# EAGLE design schody.v2 (EAGLE 9.2.2)
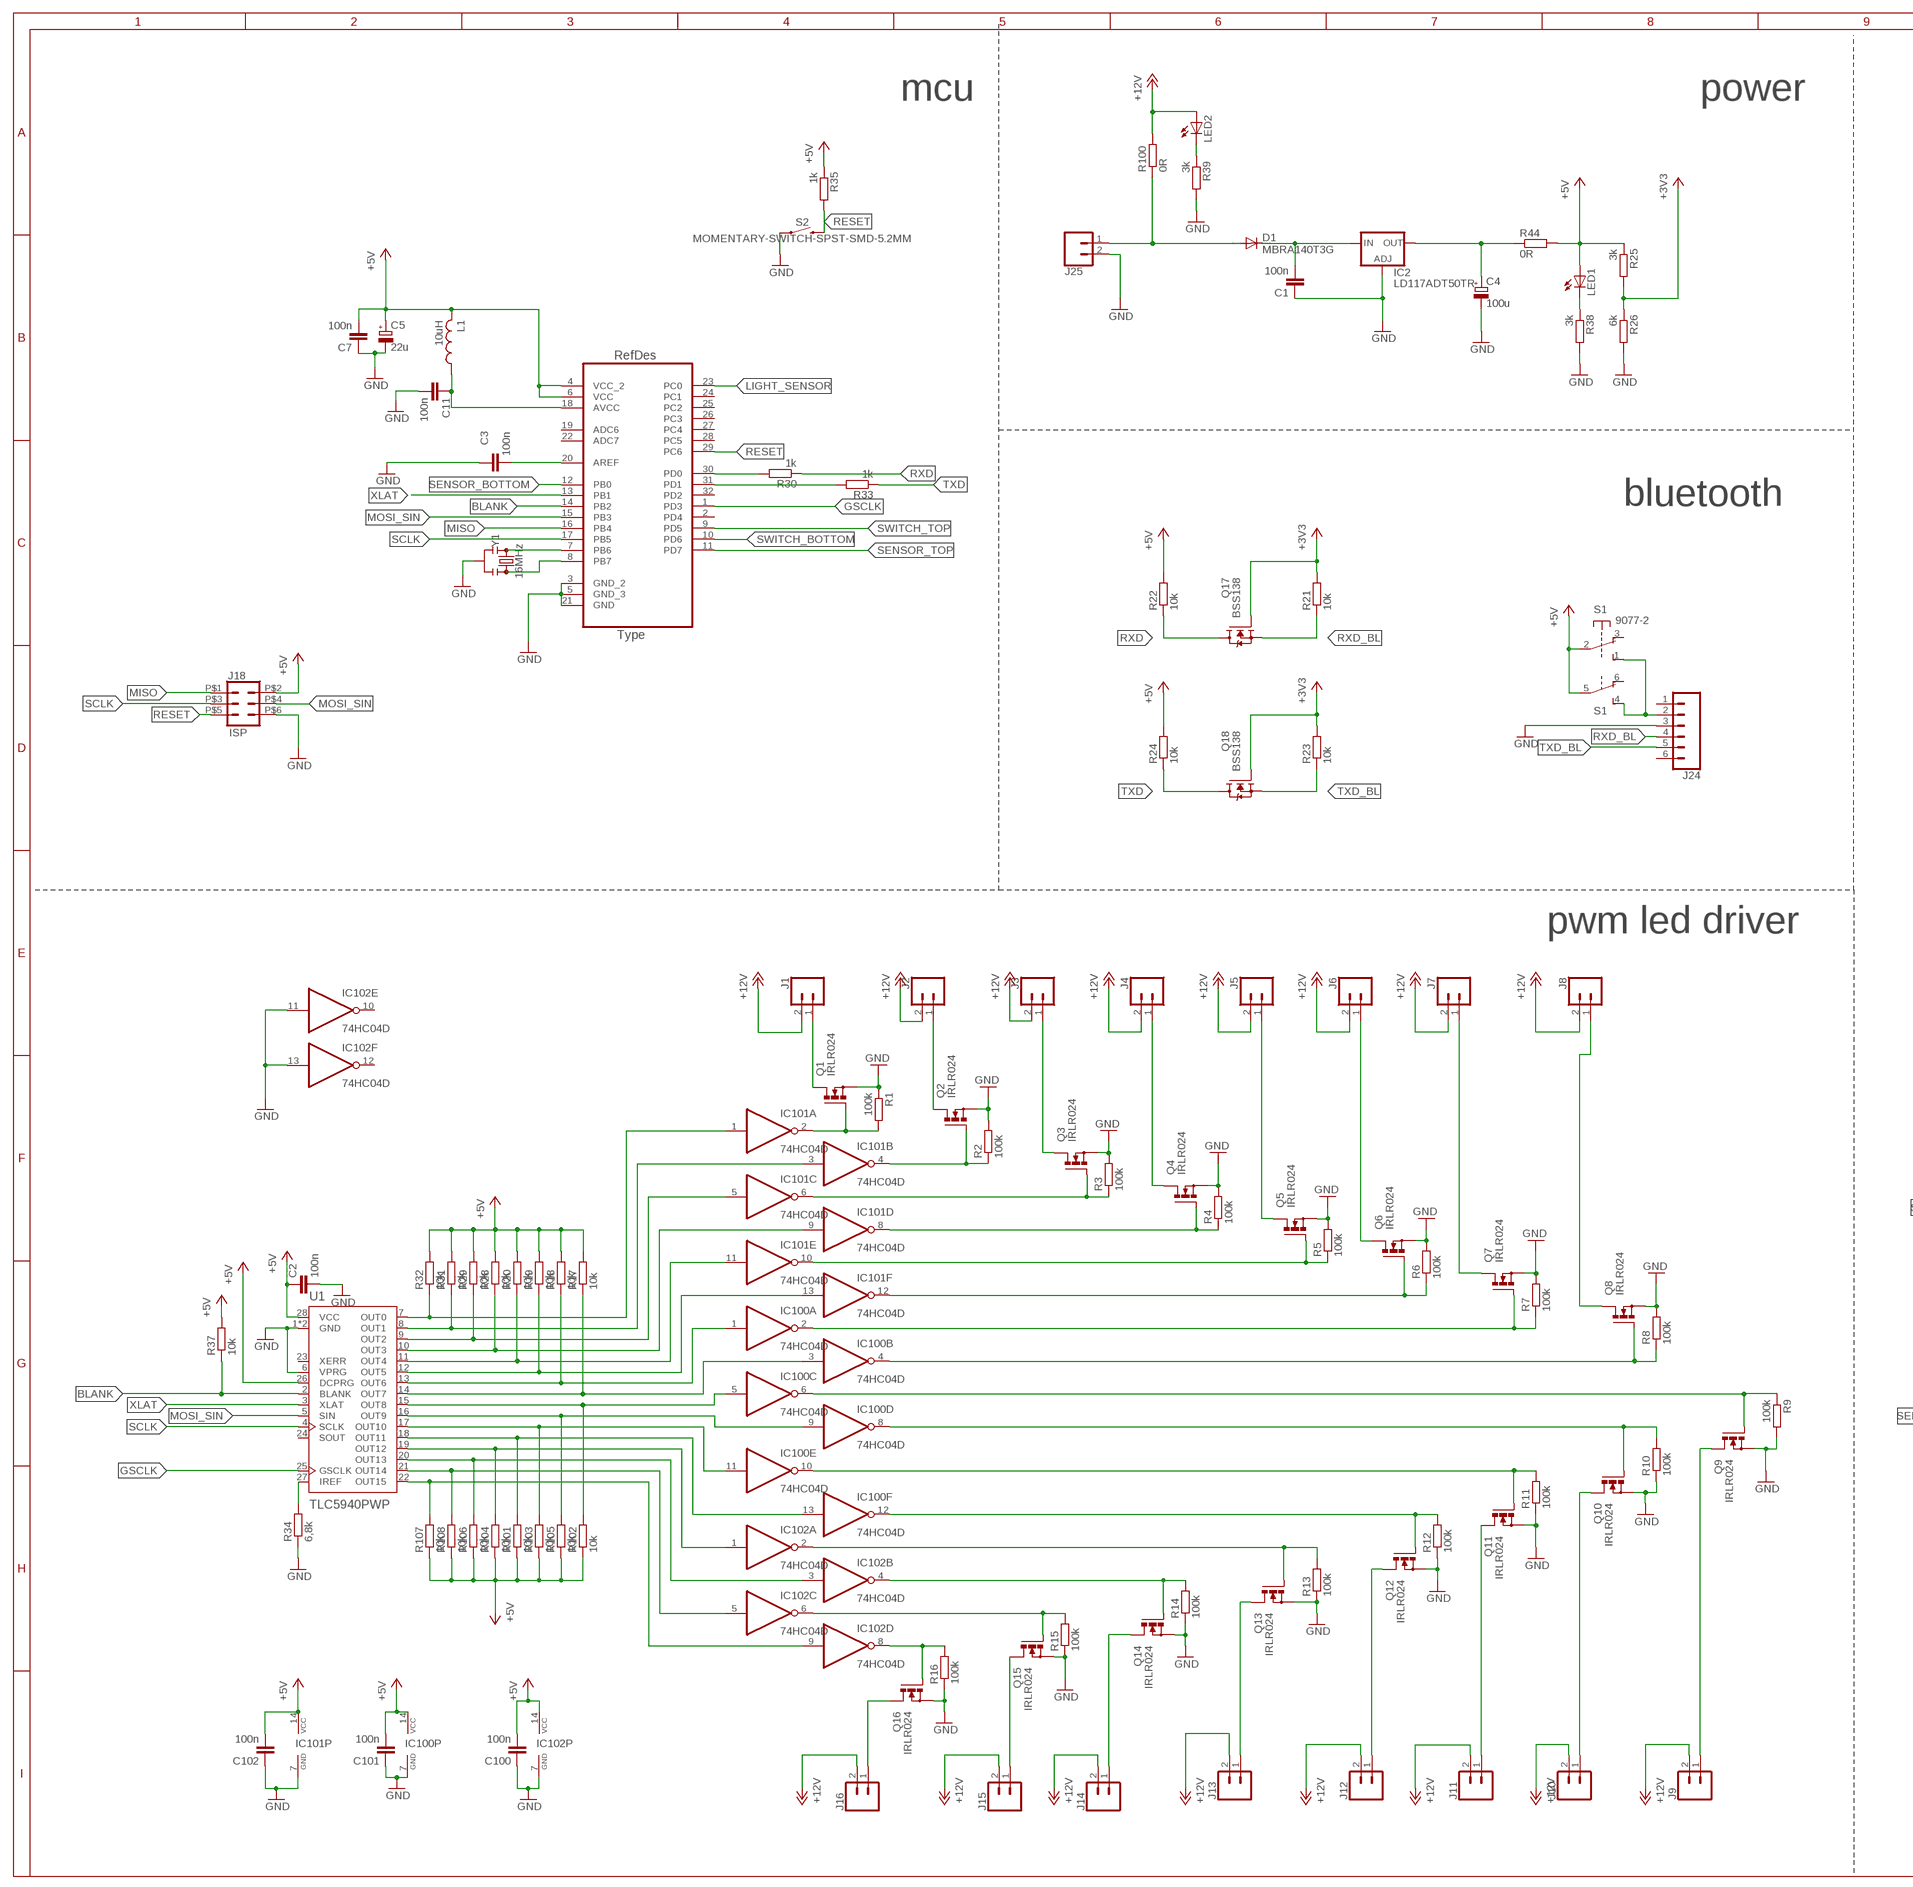
[diagram p0: schematic, sheet 1, part 1 of 2]
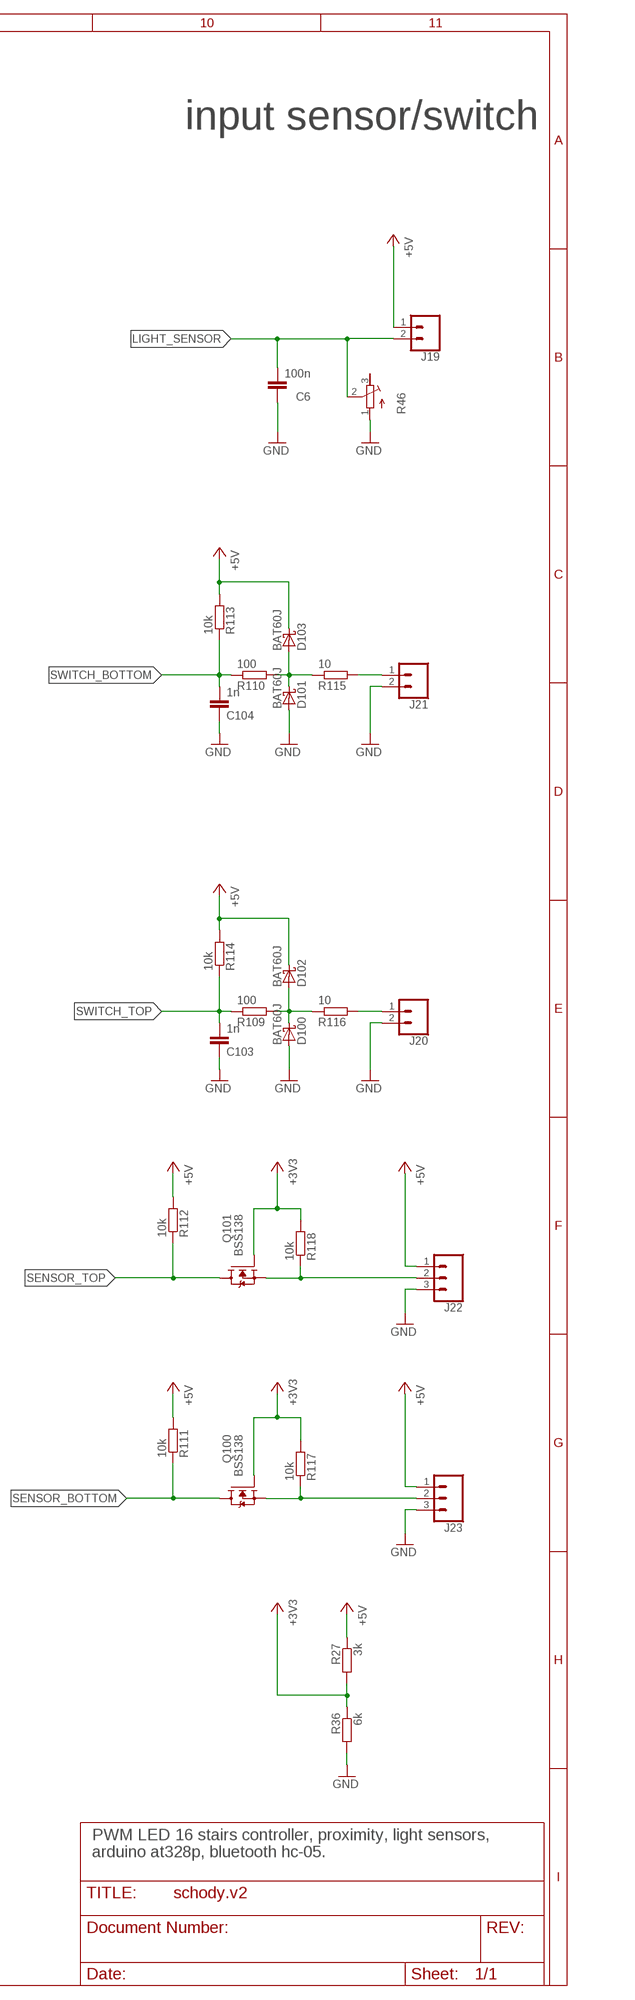
[diagram p1: schematic, sheet 1, part 2 of 2]

## Parts
C1  100n  C-EUC0805K  [C0805K]
C2  100n  C-EUC0805K  [C0805K]
C3  100n  C-EUC0805  [C0805]
C4  100u  CPOL-EUSMCD  [SMC_D]
C5  22u  CPOL-EUSMCE  [SMC_E]
C6  100n  C-EUC0805  [C0805]
C7  100n  C-EUC0805  [C0805]
C11  100n  C-EUC0805  [C0805]
C100  100n  C-EUC0805K  [C0805K]
C101  100n  C-EUC0805K  [C0805K]
C102  100n  C-EUC0805K  [C0805K]
C103  1n  C-EUC0805K  [C0805K]
C104  1n  C-EUC0805K  [C0805K]
D1  MBRA140T3G  DIODE-DO214BA  [DO214BA]
D100  BAT60J  [SOD323_ST]
D101  BAT60J  [SOD323_ST]
D102  BAT60J  [SOD323_ST]
D103  BAT60J  [SOD323_ST]
IC2  LD117ADT50TR  [DPACK]
IC100  74HC04D  [SO14]
IC101  74HC04D  [SO14]
IC102  74HC04D  [SO14]
J1  CONN_023.5MM  [SCREWTERMINAL-3.5MM-2]
J2  CONN_023.5MM  [SCREWTERMINAL-3.5MM-2]
J3  CONN_023.5MM  [SCREWTERMINAL-3.5MM-2]
J4  CONN_023.5MM  [SCREWTERMINAL-3.5MM-2]
J5  CONN_023.5MM  [SCREWTERMINAL-3.5MM-2]
J6  CONN_023.5MM  [SCREWTERMINAL-3.5MM-2]
J7  CONN_023.5MM  [SCREWTERMINAL-3.5MM-2]
J8  CONN_023.5MM  [SCREWTERMINAL-3.5MM-2]
J9  CONN_023.5MM  [SCREWTERMINAL-3.5MM-2]
J10  CONN_023.5MM  [SCREWTERMINAL-3.5MM-2]
J11  CONN_023.5MM  [SCREWTERMINAL-3.5MM-2]
J12  CONN_023.5MM  [SCREWTERMINAL-3.5MM-2]
J13  CONN_023.5MM  [SCREWTERMINAL-3.5MM-2]
J14  CONN_023.5MM  [SCREWTERMINAL-3.5MM-2]
J15  CONN_023.5MM  [SCREWTERMINAL-3.5MM-2]
J16  CONN_023.5MM  [SCREWTERMINAL-3.5MM-2]
J18  ISP  CONN_03X2POGO_PINS  [2X3_POGO]
J19  CONN_023.5MM  [SCREWTERMINAL-3.5MM-2]
J20  CONN_023.5MM  [SCREWTERMINAL-3.5MM-2]
J21  CONN_023.5MM  [SCREWTERMINAL-3.5MM-2]
J22  CONN_03SCREW  [SCREWTERMINAL-3.5MM-3]
J23  CONN_03SCREW  [SCREWTERMINAL-3.5MM-3]
J24  CONN_06LOCK  [1X06_LOCK]
J25  CONN_025MM  [SCREWTERMINAL-5MM-2]
L1  10uH  L_USB  [0805]
LED1  LEDCHIP-LED0805  [CHIP-LED0805]
LED2  LEDCHIP-LED0805  [CHIP-LED0805]
Q1  IRLR024  [D-PAK_TO252AA]
Q2  IRLR024  [D-PAK_TO252AA]
Q3  IRLR024  [D-PAK_TO252AA]
Q4  IRLR024  [D-PAK_TO252AA]
Q5  IRLR024  [D-PAK_TO252AA]
Q6  IRLR024  [D-PAK_TO252AA]
Q7  IRLR024  [D-PAK_TO252AA]
Q8  IRLR024  [D-PAK_TO252AA]
Q9  IRLR024  [D-PAK_TO252AA]
Q10  IRLR024  [D-PAK_TO252AA]
Q11  IRLR024  [D-PAK_TO252AA]
Q12  IRLR024  [D-PAK_TO252AA]
Q13  IRLR024  [D-PAK_TO252AA]
Q14  IRLR024  [D-PAK_TO252AA]
Q15  IRLR024  [D-PAK_TO252AA]
Q16  IRLR024  [D-PAK_TO252AA]
Q17  BSS138  [SOT23]
Q18  BSS138  [SOT23]
Q100  BSS138  [SOT23]
Q101  BSS138  [SOT23]
R1  100k  R-EU_M0805  [M0805]
R2  100k  R-EU_M0805  [M0805]
R3  100k  R-EU_M0805  [M0805]
R4  100k  R-EU_M0805  [M0805]
R5  100k  R-EU_M0805  [M0805]
R6  100k  R-EU_M0805  [M0805]
R7  100k  R-EU_M0805  [M0805]
R8  100k  R-EU_M0805  [M0805]
R9  100k  R-EU_M0805  [M0805]
R10  100k  R-EU_M0805  [M0805]
R11  100k  R-EU_M0805  [M0805]
R12  100k  R-EU_M0805  [M0805]
R13  100k  R-EU_M0805  [M0805]
R14  100k  R-EU_M0805  [M0805]
R15  100k  R-EU_M0805  [M0805]
R16  100k  R-EU_M0805  [M0805]
R17  10k  R-EU_M0805  [M0805]
R18  10k  R-EU_M0805  [M0805]
R19  10k  R-EU_M0805  [M0805]
R20  10k  R-EU_M0805  [M0805]
R21  10k  R-EU_M0805  [M0805]
R22  10k  R-EU_M0805  [M0805]
R23  10k  R-EU_M0805  [M0805]
R24  10k  R-EU_M0805  [M0805]
R25  3k  R-EU_M0805  [M0805]
R26  6k  R-EU_M0805  [M0805]
R27  3k  R-EU_M0805  [M0805]
R28  10k  R-EU_M0805  [M0805]
R29  10k  R-EU_M0805  [M0805]
R30  1k  R-EU_M0805  [M0805]
R31  10k  R-EU_M0805  [M0805]
R32  10k  R-EU_M0805  [M0805]
R33  1k  R-EU_M0805  [M0805]
R34  6,8k  R-EU_M0805  [M0805]
R35  1k  R-EU_M0805  [M0805]
R36  6k  R-EU_M0805  [M0805]
R37  10k  R-EU_M0805  [M0805]
R38  3k  R-EU_M0805  [M0805]
R39  3k  R-EU_M0805  [M0805]
R44  0R  R-EU_M1206  [M1206]
R46  R-TRIMM64W  [RTRIM64W]
R100  0R  R-EU_R2512  [R2512]
R101  10k  R-EU_M0805  [M0805]
R102  10k  R-EU_M0805  [M0805]
R103  10k  R-EU_M0805  [M0805]
R104  10k  R-EU_M0805  [M0805]
R105  10k  R-EU_M0805  [M0805]
R106  10k  R-EU_M0805  [M0805]
R107  10k  R-EU_M0805  [M0805]
R108  10k  R-EU_M0805  [M0805]
R109  100  R-EU_M0805  [M0805]
R110  100  R-EU_M0805  [M0805]
R111  10k  R-EU_M0805  [M0805]
R112  10k  R-EU_M0805  [M0805]
R113  10k  R-EU_M0805  [M0805]
R114  10k  R-EU_M0805  [M0805]
R115  10  R-EU_M0805  [M0805]
R116  10  R-EU_M0805  [M0805]
R117  10k  R-EU_M0805  [M0805]
R118  10k  R-EU_M0805  [M0805]
S1  9077-2  [9077-2]
S2  MOMENTARY-SWITCH-SPST-SMD-5.2MM  [TACTILE_SWITCH_SMD_5.2MM]
U1  TLC5940PWP  [HTSSOP28PWP]
U2  ATMEGA328P-AU  [QFP80P900X900X120-32N]
Y1  16MHz  RESONATOR-16MHZSMD_3.2X1.3  [RESONATOR-SMD-3.2X1.3]

## Nets
+3V3: Q17.1(G) Q18.1(G) R21.2 R23.2 R25.2 R26.1
+3V33: Q100.1(G) Q101.1(G) R27.2 R36.1 R117.2 R118.2 ; supply symbol labelled +3V3
+5V: C2.1 C5.+ C7.2 C100.2 C101.2 C102.2 D102.C D103.C IC100.14(P:VCC) IC101.14(P:VCC) IC102.14(P:VCC) J18.P$2 J19.1 J22.1 J23.1 L1.2 LED1.A R17.2 R18.2 R19.2 R20.2 R22.2 R24.2 R25.1 R27.1 R28.2 R29.2 R31.2 R32.2 R35.1 R37.2 R44.2 R101.1 R102.1 R103.1 R104.1 R105.1 R106.1 R107.1 R108.1 R111.2 R112.2 R113.2 R114.2 S1.2(1:P) S1.5(2:P) U1.26(DCPRG) U1.28(VCC) U2.4(VCC_2) U2.6(VCC)
+12V: J1.2 J2.2 J3.2 J4.2 J5.2 J6.2 J7.2 J8.2 J9.2 J10.2 J11.2 J12.2 J13.2 J14.2 J15.2 J16.2 LED2.A R100.2
BLANK: R37.1 U1.2(BLANK) U2.14(PB2)
GND: C1.1 C2.2 C3.1 C4.- C5.- C6.1 C7.1 C11.2 C100.1 C101.1 C102.1 C103.1 C104.1 D100.A D101.A IC2.1(ADJ) IC100.7(P:GND) IC101.7(P:GND) IC102.7(P:GND) IC102.11(E:I) IC102.13(F:I) J18.P$6 J20.2 J21.2 J22.3 J23.3 J24.3 J25.2 Q1.3(SOURCE) Q2.3(SOURCE) Q3.3(SOURCE) Q4.3(SOURCE) Q5.3(SOURCE) Q6.3(SOURCE) Q7.3(SOURCE) Q8.3(SOURCE) Q9.3(SOURCE) Q10.3(SOURCE) Q11.3(SOURCE) Q12.3(SOURCE) Q13.3(SOURCE) Q14.3(SOURCE) Q15.3(SOURCE) Q16.3(SOURCE) R1.1 R2.2 R3.2 R4.2 R5.2 R6.2 R7.2 R8.2 R9.2 R10.1 R11.1 R12.1 R13.1 R14.1 R15.1 R16.1 R26.2 R34.1 R36.2 R38.2 R39.2 R46.1(A) S2.1 U1.1(GND) U1.6(VPRG) U1.EXP(GND) U2.3(GND_2) U2.5(GND_3) U2.21(GND) Y1.2
GSCLK: U1.25(GSCLK) U2.1(PD3)
LIGHT_SENSOR: C6.2 J19.2 R46.2(S) U2.23(PC0)
MISO: J18.P$1 U2.16(PB4)
MOSI_SIN: J18.P$4 U1.5(SIN) U2.15(PB3)
N$1: IC101.1(A:I) R32.1 U1.7(OUT0)
N$2: IC101.3(B:I) R31.1 U1.8(OUT1)
N$3: IC101.5(C:I) R29.1 U1.9(OUT2)
N$4: IC101.9(D:I) R28.1 U1.10(OUT3)
N$5: IC101.11(E:I) R20.1 U1.11(OUT4)
N$6: IC101.13(F:I) R19.1 U1.12(OUT5)
N$7: IC100.1(A:I) R18.1 U1.13(OUT6)
N$8: IC100.3(B:I) R17.1 U1.14(OUT7)
N$9: IC102.9(D:I) R107.2 U1.22(OUT15)
N$10: IC101.2(A:O) Q1.1(GATE) R1.2
N$11: IC102.3(B:I) R106.2 U1.20(OUT13)
N$12: IC102.1(A:I) R104.2 U1.19(OUT12)
N$13: IC100.13(F:I) R101.2 U1.18(OUT11)
N$14: IC100.11(E:I) R103.2 U1.17(OUT10)
N$15: IC100.9(D:I) R105.2 U1.16(OUT9)
N$16: IC100.5(C:I) R102.2 U1.15(OUT8)
N$17: IC102.5(C:I) R108.2 U1.21(OUT14)
N$18: J2.1 Q2.2(DRAIN)
N$19: IC101.6(C:O) Q3.1(GATE) R3.1
N$20: J4.1 Q4.2(DRAIN)
N$21: IC100.4(B:O) Q8.1(GATE) R8.1
N$22: J3.1 Q3.2(DRAIN)
N$23: IC101.8(D:O) Q4.1(GATE) R4.1
N$24: IC102.8(D:O) Q16.1(GATE) R16.2
N$25: J16.1 Q16.2(DRAIN)
N$26: J1.1 Q1.2(DRAIN)
N$27: IC101.10(E:O) Q5.1(GATE) R5.1
N$28: J5.1 Q5.2(DRAIN)
N$29: J8.1 Q8.2(DRAIN)
N$30: IC101.12(F:O) Q6.1(GATE) R6.1
N$31: J10.1 Q10.2(DRAIN)
N$32: J6.1 Q6.2(DRAIN)
N$33: IC102.6(C:O) Q15.1(GATE) R15.2
N$34: J15.1 Q15.2(DRAIN)
N$35: J24.2 S1.1(1:S) S1.4(2:S)
N$36: IC102.4(B:O) Q14.1(GATE) R14.2
N$37: J14.1 Q14.2(DRAIN)
N$38: IC100.8(D:O) Q10.1(GATE) R10.2
N$39: IC102.2(A:O) Q13.1(GATE) R13.2
N$40: IC100.6(C:O) Q9.1(GATE) R9.1
N$41: J13.1 Q13.2(DRAIN)
N$42: J20.1 R116.2
N$43: IC100.12(F:O) Q12.1(GATE) R12.2
N$44: J12.1 Q12.2(DRAIN)
N$45: J9.1 Q9.2(DRAIN)
N$46: IC100.10(E:O) Q11.1(GATE) R11.2
N$47: J11.1 Q11.2(DRAIN)
N$48: J21.1 R115.2
N$49: R30.2 U2.30(PD0)
N$50: R33.2 U2.31(PD1)
N$51: C1.2 D1.C IC2.3(IN)
N$52: D1.A J25.1 R100.1
N$53: U2.7(PB6) Y1.1
N$54: U2.8(PB7) Y1.3
N$55: R34.2 U1.27(IREF)
N$56: LED1.C R38.1
N$57: D101.C D103.A R110.2 R115.1
N$58: LED2.C R39.1
N$59: D100.C D102.A R109.2 R116.1
N$63: J22.2 Q101.2(S) R118.1
N$64: J23.2 Q100.2(S) R117.1
N$65: C11.1 L1.1 U2.18(AVCC)
N$66: C4.+ IC2.4(OUT) R44.1
N$67: C3.2 U2.20(AREF)
N$70: IC101.4(B:O) Q2.1(GATE) R2.1
N$71: IC100.2(A:O) Q7.1(GATE) R7.1
N$73: J7.1 Q7.2(DRAIN)
RESET: J18.P$5 R35.2 S2.3 U2.29(PC6)
RXD: Q17.3(D) R22.1 R30.1
RXD_BL: J24.4 Q17.2(S) R21.1
SCLK: J18.P$3 U1.4(SCLK) U2.17(PB5)
SENSOR_BOTTOM: Q100.3(D) R111.1 U2.12(PB0)
SENSOR_TOP: Q101.3(D) R112.1 U2.11(PD7)
SWITCH_BOTTOM: C104.2 R110.1 R113.1 U2.10(PD6)
SWITCH_TOP: C103.2 R109.1 R114.1 U2.9(PD5)
TXD: Q18.3(D) R24.1 R33.1
TXD_BL: J24.5 Q18.2(S) R23.1
XLAT: U1.3(XLAT) U2.13(PB1)
Unconnected: IC102.10(E:O) IC102.12(F:O) J24.1 J24.6 R46.3(E) S1.3(1:O) S1.6(2:O) U1.23(XERR) U1.24(SOUT) U2.2(PD4) U2.19(ADC6) U2.22(ADC7) U2.24(PC1) U2.25(PC2) U2.26(PC3) U2.27(PC4) U2.28(PC5) U2.32(PD2)

## Notes on the sheet
- mcu | power
- input sensor/switch
- bluetooth
- pwm led driver
- PWM LED 16 stairs controller, proximity, light sensors, 
  arduino at328p, bluetooth hc-05.

## Library data of the parts
C1-C3 C6 C7 C11 C100-C104 = rcl:C-EU: CAPACITOR, European symbol; SPICEPREFIX: C
C4 C5 = rcl:CPOL-EU: POLARIZED CAPACITOR, European symbol; SPICEPREFIX: C
D1 = diode:DIODE-: DIODE
D100 D102 = diode:BAT60J: Schottky barrier diode Source: www.st.com, BAT60J.pdf; SPICEPREFIX: D
D101 D103 = diode:BAT60J: Schottky barrier diode Source: www.st.com, BAT60J.pdf
IC2 = v-reg:LD117A?*: Low drop fixed and adjustable positive voltage regulators 1 A Source: http://www.st.com/stonline/products/literature/ds/7194/ld1117axx.pdf
IC100-IC102 = 74xx-eu:74*04: Hex INVERTER
J1-J16 J19-J21 = SparkFun-Connectors:CONN_02: Multi connection point. Often used as Generic Header-pin footprint for 0.1 inch spaced/style header connections On any of the 0.1 inch spaced packages, you can populate with these: Break Away Headers - Straight <https://www.sparkfun.com/products/116> (PRT-00116) Break Away Male Headers - Right Angle <https://www.sparkfun.com/products/553> (PRT-00553) Female Headers <https://www.sparkfun.com/products/115> (PRT-00115) Break Away Headers - Machine Pin <https://www.sparkfun.com/products/117> (PRT-00117) Break Away Female Headers - Swiss Machine Pin <https://www.sparkfun.com/products/743> (PRT-00743) For SCREWTERMINALS and SPRING TERMINALS visit here: Screw Terimnals on SparkFun.com <https://www.sparkfun.com/search/results?term=Screw+Terminals> (5mm/3.5mm/2.54mm spacing) This device is also useful as a general connection point to wire up your design to another part of your project. Our various solder wires solder well into these plated through hole pads. Hook-Up Wire - Assortment (Stranded, 22 AWG) <https://www.sparkfun.com/products/11375> (PRT-11375) Hook-Up Wire - Assortment (Solid Core, 22 AWG) <https://www.sparkfun.com/products/11367> (PRT-11367) View the entire wire category on our website here <https://www.sparkfun.com/categories/141> Special notes: Molex polarized connector foot print use with: PRT-08233 with associated crimp pins and housings. 2.54_SCREWTERM for use with PRT-10571. 3.5mm Screw Terminal footprints for PRT-08084 5mm Screw Terminal footprints for use with PRT-08432; PROD_ID: CONN-08399
J18 = SparkFun-Connectors:CONN_03X2: Multi connection point. Often used as Generic Header-pin footprint for 0.1 inch spaced/style header connections You can populate with any combo of single row headers, but if you'd like an exact match, check these: Header - 2x3 (Male, 0.1") <https://www.sparkfun.com/products/12807> (PRT-12807) Header - 2x3 (Female, 0.1") <https://www.sparkfun.com/products/13010> (PRT-13010) 2x3 Pin Shrouded Header <https://www.sparkfun.com/products/10877> (PRT-10877) On any of the 0.1 inch spaced packages, you can populate with these: Break Away Headers - Straight <https://www.sparkfun.com/products/116> (PRT-00116) Break Away Male Headers - Right Angle <https://www.sparkfun.com/products/553> (PRT-00553) Female Headers <https://www.sparkfun.com/products/115> (PRT-00115) Break Away Headers - Machine Pin <https://www.sparkfun.com/products/117> (PRT-00117) Break Away Female Headers - Swiss Machine Pin <https://www.sparkfun.com/products/743> (PRT-00743) Special note: the shrouded connector mates well with our 3x2 ribbon cables: Ribbon Crimp Connector - 6-pin (2x3, Female) <https://www.sparkfun.com/products/10651> (PRT-10651) Ribbon Cable - 6 wire (15ft) <https://www.sparkfun.com/products/10646> (PRT-10646); PROD_ID: HW-11044
J22 J23 = SparkFun-Connectors:CONN_03: Multi connection point. Often used as Generic Header-pin footprint for 0.1 inch spaced/style header connections On any of the 0.1 inch spaced packages, you can populate with these: Break Away Headers - Straight <https://www.sparkfun.com/products/116> (PRT-00116) Break Away Male Headers - Right Angle <https://www.sparkfun.com/products/553> (PRT-00553) Female Headers <https://www.sparkfun.com/products/115> (PRT-00115) Break Away Headers - Machine Pin <https://www.sparkfun.com/products/117> (PRT-00117) Break Away Female Headers - Swiss Machine Pin <https://www.sparkfun.com/products/743> (PRT-00743) Stackable Header - 3 Pin (Female, 0.1") <https://www.sparkfun.com/products/13875> (PRT-13875) For SCREWTERMINALS and SPRING TERMINALS visit here: Screw Terimnals on SparkFun.com <https://www.sparkfun.com/search/results?term=Screw+Terminals> (5mm/3.5mm/2.54mm spacing) This device is also useful as a general connection point to wire up your design to another part of your project. Our various solder wires solder well into these plated through hole pads. Hook-Up Wire - Assortment (Stranded, 22 AWG) <https://www.sparkfun.com/products/11375> (PRT-11375) Hook-Up Wire - Assortment (Solid Core, 22 AWG) <https://www.sparkfun.com/products/11367> (PRT-11367) View the entire wire category on our website here <https://www.sparkfun.com/categories/141> Special notes: Molex polarized connector foot print use with SKU : PRT-08232 with associated crimp pins and housings.; PROD_ID: CONN-08288; SF_ID: PRT-08235
J24 = SparkFun-Connectors:CONN_06: Multi connection point. Often used as Generic Header-pin footprint for 0.1 inch spaced/style header connections On any of the 0.1 inch spaced packages, you can populate with these: Break Away Headers - Straight <https://www.sparkfun.com/products/116> (PRT-00116) Break Away Male Headers - Right Angle <https://www.sparkfun.com/products/553> (PRT-00553) Female Headers <https://www.sparkfun.com/products/115> (PRT-00115) Break Away Headers - Machine Pin <https://www.sparkfun.com/products/117> (PRT-00117) Break Away Female Headers - Swiss Machine Pin <https://www.sparkfun.com/products/743> (PRT-00743) Arduino Stackable Header - 6 Pin <https://www.sparkfun.com/products/9280> (PRT-09280) For SCREWTERMINALS and SPRING TERMINALS visit here: Screw Terimnals on SparkFun.com <https://www.sparkfun.com/search/results?term=Screw+Terminals> (5mm/3.5mm/2.54mm spacing) This device is also useful as a general connection point to wire up your design to another part of your project. Our various solder wires solder well into these plated through hole pads. Hook-Up Wire - Assortment (Stranded, 22 AWG) <https://www.sparkfun.com/products/11375> (PRT-11375) Hook-Up Wire - Assortment (Solid Core, 22 AWG) <https://www.sparkfun.com/products/11367> (PRT-11367) View the entire wire category on our website here <https://www.sparkfun.com/categories/141>
J25 = SparkFun-Connectors:CONN_02: Multi connection point. Often used as Generic Header-pin footprint for 0.1 inch spaced/style header connections On any of the 0.1 inch spaced packages, you can populate with these: Break Away Headers - Straight <https://www.sparkfun.com/products/116> (PRT-00116) Break Away Male Headers - Right Angle <https://www.sparkfun.com/products/553> (PRT-00553) Female Headers <https://www.sparkfun.com/products/115> (PRT-00115) Break Away Headers - Machine Pin <https://www.sparkfun.com/products/117> (PRT-00117) Break Away Female Headers - Swiss Machine Pin <https://www.sparkfun.com/products/743> (PRT-00743) For SCREWTERMINALS and SPRING TERMINALS visit here: Screw Terimnals on SparkFun.com <https://www.sparkfun.com/search/results?term=Screw+Terminals> (5mm/3.5mm/2.54mm spacing) This device is also useful as a general connection point to wire up your design to another part of your project. Our various solder wires solder well into these plated through hole pads. Hook-Up Wire - Assortment (Stranded, 22 AWG) <https://www.sparkfun.com/products/11375> (PRT-11375) Hook-Up Wire - Assortment (Solid Core, 22 AWG) <https://www.sparkfun.com/products/11367> (PRT-11367) View the entire wire category on our website here <https://www.sparkfun.com/categories/141> Special notes: Molex polarized connector foot print use with: PRT-08233 with associated crimp pins and housings. 2.54_SCREWTERM for use with PRT-10571. 3.5mm Screw Terminal footprints for PRT-08084 5mm Screw Terminal footprints for use with PRT-08432; SF_SKU: PRT-08432
L1 = m-pad-2.1:L_US: Inductors in various packages from: - Sumida - Panasonic - Coilcraft
LED1 LED2 = adafruit:LED: LED OSRAM: - CHIPLED LG R971, LG N971, LY N971, LG Q971, LY Q971, LO R971, LY R971 LH N974, LH R974 LS Q976, LO Q976, LY Q976 LO Q996 - Hyper CHIPLED LW Q18S LB Q993, LB Q99A, LB R99A - SideLED LS A670, LO A670, LY A670, LG A670, LP A670 LB A673, LV A673, LT A673, LW A673 LH A674 LY A675 LS A676, LA A676, LO A676, LY A676, LW A676 LS A679, LY A679, LG A679 - Hyper Micro SIDELED® LS Y876, LA Y876, LO Y876, LY Y876 LT Y87S - SmartLED LW L88C, LW L88S LB L89C, LB L89S, LG L890 LS L89K, LO L89K, LY L89K LS L896, LA L896, LO L896, LY L896 - TOPLED LS T670, LO T670, LY T670, LG T670, LP T670 LSG T670, LSP T670, LSY T670, LOP T670, LYG T670 LG T671, LOG T671, LSG T671 LB T673, LV T673, LT T673, LW T673 LH T674 LS T676, LA T676, LO T676, LY T676, LB T676, LH T676, LSB T676, LW T676 LB T67C, LV T67C, LT T67C, LS T67K, LO T67K, LY T67K, LW E67C LS E67B, LA E67B, LO E67B, LY E67B, LB E67C, LV E67C, LT E67C LW T67C LS T679, LY T679, LG T679 LS T770, LO T770, LY T770, LG T770, LP T770 LB T773, LV T773, LT T773, LW T773 LH T774 LS E675, LA E675, LY E675, LS T675 LS T776, LA T776, LO T776, LY T776, LB T776 LHGB T686 LT T68C, LB T68C - Hyper Mini TOPLED® LB M676 - Mini TOPLED Santana® LG M470 LS M47K, LO M47K, LY M47K Source: http://www.osram.convergy.de/
Q1-Q16 = IRLR024:IRLR024
Q17 Q18 Q100 Q101 = bss138_10:BSS138: BSS138 N-Channel Logic Level Enhancement Mode Field Effect Transistor Source: http://www.fairchildsemi.com/datasheets/BS/BSS138.pdf; MF: Fairchild; MPN: BSS138; OC_FARNELL: 9845330; OC_NEWARK: 67R2009
R1-R24 R28 R29 R31 R32 R34 R37 R100-R108 R110-R113 R115 R117 R118 = resistor:R-EU_: RESISTOR, European symbol
R25-R27 R30 R33 R35 R36 R38 R39 R44 = rcl:R-EU_: RESISTOR, European symbol; SPICEPREFIX: R
R46 = resistor:R-TRIMM: Trimm resistor
R109 R114 R116 = resistor:R-EU_: RESISTOR, European symbol; SPICEPREFIX: R
S1 = switch-misc:9077-2: MARQUARDT SWITCH 9077.0200 Distributor: Buerklin <https://www.buerklin.com/default.asp?event=ShowArtikel%2812G2822%29&l=d&jump=ArtNr_12G2822>
S2 = SparkFun-Switches:MOMENTARY-SWITCH-SPST: Momentary Switch (Pushbutton) - SPST Normally-open (NO) SPST momentary switches (buttons, pushbuttons). Variants PTH-12MM - 12mm square, through-hole Momentary Pushbutton Switch - 12mm Square <https://www.sparkfun.com/products/9190> (COM-09190) PTH-6.0MM, PTH-6.0MM-KIT - 6.0mm square, through-hole Mini Pushbutton Switch <https://www.sparkfun.com/products/97> (COM-00097) KIT package intended for soldering kit's - only one side of pads' copper is exposed. PTH-RIGHT-ANGLE-KIT - Right-angle, through-hole Right Angle Tactile Button <https://www.sparkfun.com/products/10791> - Used on SparkFun BigTime Watch Kit <https://www.sparkfun.com/products/11734> SMD-12MM - 12mm square, surface-mount Tactile Button - SMD (12mm) <https://www.sparkfun.com/products/12993> (COM-12993) Used on SparkFun PicoBoard <https://www.sparkfun.com/products/11888> SMD-4.5MM - 4.5mm Square Trackball Switch Used on SparkFun Blackberry Trackballer Breakout <https://www.sparkfun.com/products/13169> SMD-4.6MMX2.8MM - 4.60mm x 2.80mm, surface mount Used on SparkFun SAMD21 Mini Breakout <https://www.sparkfun.com/products/13664> SMD-5.2MM, SMD-5.2-REDUNDANT - 5.2mm square, surface-mount Mini Pushbutton Switch - SMD <https://www.sparkfun.com/products/8720> (COM-08720) Used on Arduino Pro Mini <https://www.sparkfun.com/products/11114> REDUNDANT package connects both switch circuits together SMD-6.0X3.5MM - 6.0 x 3.5mm, surface mount Momentary Reset Switch SMD <https://www.sparkfun.com/products/8229> (COM-08229) SMD-6.2MM-TALL - 6.2mm square, surface mount Tactile Button - SMD (6mm) <https://www.sparkfun.com/products/12992> Used on SparkFun Digital Sandbox <https://www.sparkfun.com/products/12651> SMD-RIGHT-ANGLE - Right-angle, surface mount Used on SparkFun Block for Intel® Edison - Arduino <https://www.sparkfun.com/products/13036>; PROD_ID: SWCH-08247; SF_SKU: COM-08720
U1 = tlc5940a:TLC5940
U2 = Atmel-ATMEGA328P-AU:ATMEGA328P-AU; DESCRIPTION: 8-bit Microcontroller with In-System Programmable Flash; MPN: ATMEGA328P-AU; OC_FARNELL: 1715486; OC_NEWARK: 14R4631; PACKAGE: TQFP-32; SUPPLIER: Atmel
Y1 = SparkFun-Clocks:RESONATOR-16MHZ: 16MHz Resonator Digikey Example <http://www.digikey.com/product-detail/en/murata-electronics-north-america/CSTCE16M0V53-R0/490-1198-1-ND/584635> Frequency: 16MHz Frequency Stability: ±0.3% Frequency Tolerance: ±0.5% Capacitance: 15pF SparkFun Products SparkFun OpenLog <https://www.sparkfun.com/products/13712> SparkFun MicroView - OLED Arduino Module <https://www.sparkfun.com/products/12923>; PROD_ID: XTAL-08900

## Board
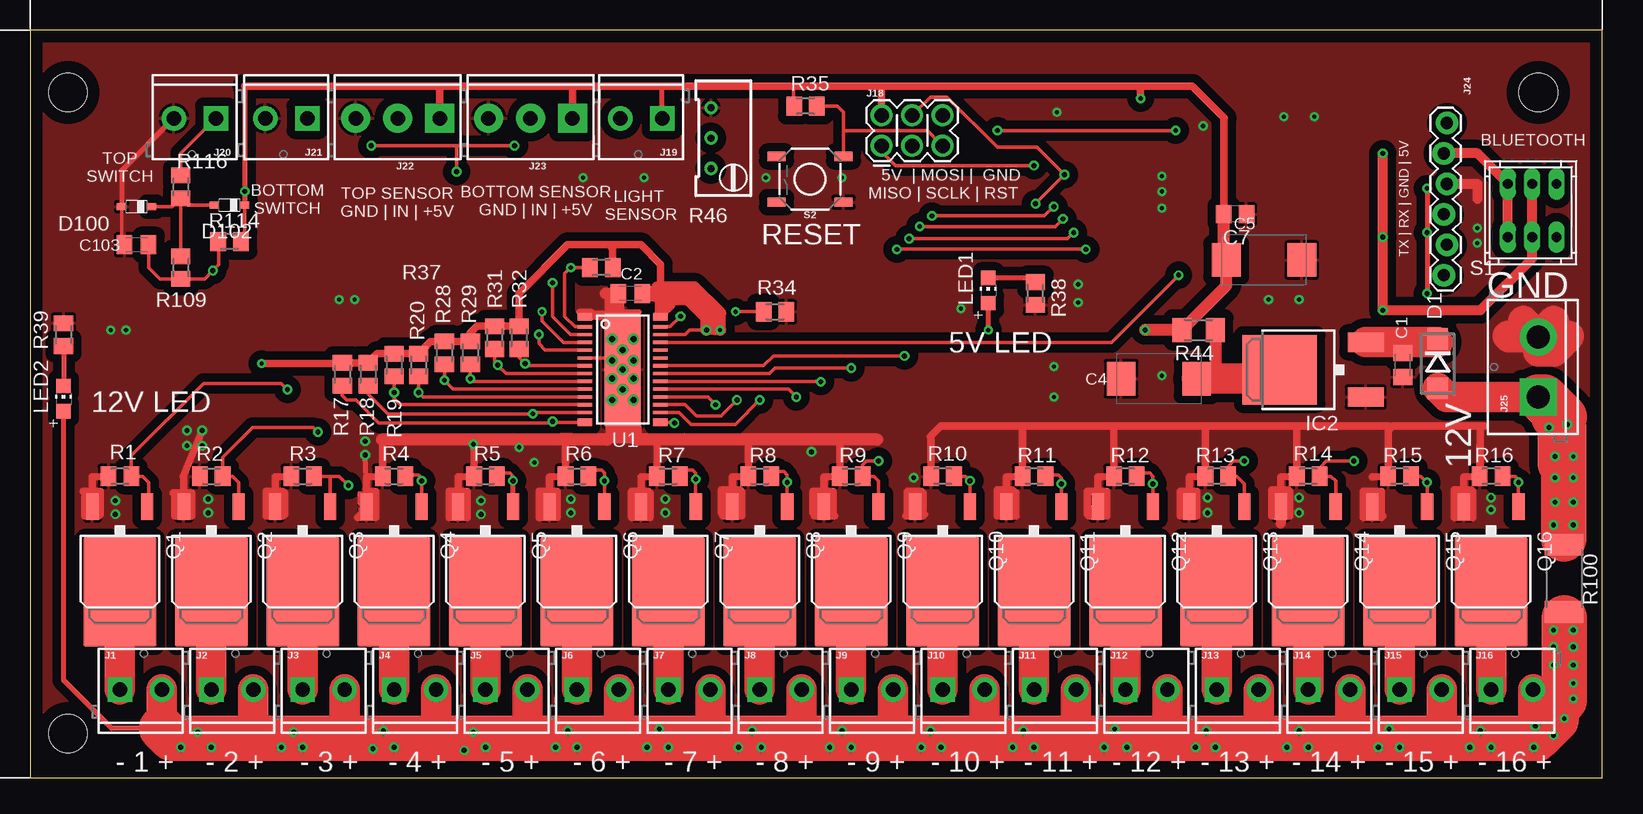
[diagram p2: board, top side]
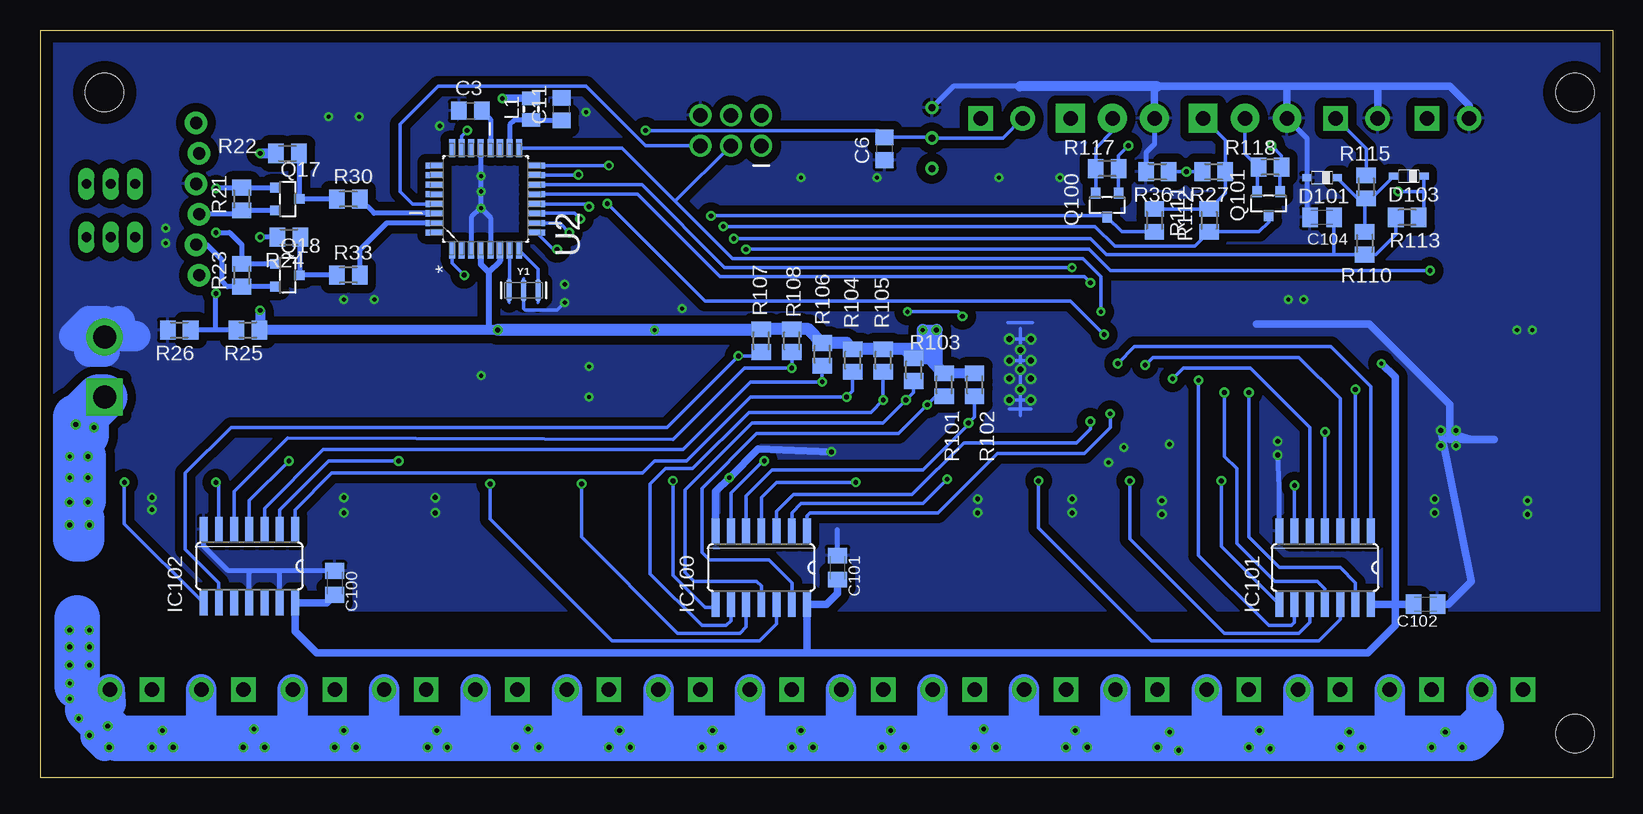
[diagram p3: board, bottom side, seen from below]

Size 131.06 x 62.36 mm. Coordinates in mm from the lower left corner, seen from the top.
Outline: 0,0 131.06,0 131.06,62.36 0,62.36 0,0
Copper layers (1*16): Top 0.035mm / dielectric 1.5mm / Bottom 0.035mm
Design rules "default *": minimum track width 3mil, minimum drill 0.35mm, track to track 6mil, track to pad 6mil, pad to pad 6mil, via to via 6mil, smd to smd 6mil, copper to edge 40mil, drill to drill 6mil, minimum pad ring 10mil, minimum via ring 8mil, stop-mask expansion 4mil, vias tented up to drill 0mil, thermal gap 10mil
Holes 3.2 mm at 3.17,3.68 3.17,57.15 125.73,57.15

### Footprints (pad centres in the part's own frame; a part is rotated, then mirrored left to right if it is on the bottom)
C0805K = smd 1.3 x 1.6: 1 -1,0; 2 1,0
C0805 = smd 1.3 x 1.5: 1 -0.95,0; 2 0.95,0
SMC_D = smd 2.4 x 2.8: + -3.15,0; - 3.15,0
SMC_E = smd 2.4 x 2.8: + -3.15,0; - 3.15,0
DO214BA = smd 1.8 x 1.7: A 2.05,0; C -2.05,0
SOD323_ST = smd 0.8 x 0.6: A 1.25,0; C -1.25,0
DPACK = smd 1.6 x 3: 1 -2.28,-4.8; 3 2.28,-4.8 | smd 5.8 x 6.2: 4 0,2.38
SO14 = smd 0.66 x 2.032: 1 -3.81,-3.073; 2 -2.54,-3.073; 3 -1.27,-3.073; 4 0,-3.073; 5 1.27,-3.073; 6 2.54,-3.073; 7 3.81,-3.073; 8 3.81,3.073; 9 2.54,3.073; 10 1.27,3.073; 11 0,3.073; 12 -1.27,3.073; 13 -2.54,3.073; 14 -3.81,3.073
SCREWTERMINAL-3.5MM-2 = drill 1.2 pad 2.032 square: 1 0,0 | drill 1.2 pad 2.032: 2 3.5,0
2X3_POGO = drill 1.2 pad 1.829: P$1 0,0; P$2 0,2.54; P$3 2.54,0; P$4 2.54,2.54; P$5 5.08,0; P$6 5.08,2.54
SCREWTERMINAL-3.5MM-3 = drill 1.2 pad 2.413 square: 1 0,0 | drill 1.2 pad 2.413: 2 3.5,0; 3 7,0
1X06_LOCK = drill 1.016 pad 1.88: 1 0,0; 2 2.54,-0.254; 3 5.08,0; 4 7.62,-0.254; 5 10.16,0; 6 12.7,-0.254
SCREWTERMINAL-5MM-2 = drill 1.91 pad 3.048 square: 1 0,0 | drill 1.91 pad 3.048: 2 5,0
0805 = smd 1.1 x 1.5: 1 -0.9,0; 2 0.9,0
CHIP-LED0805 = smd 1.2 x 1.2: A 0,-1.05; C 0,1.05
D-PAK_TO252AA = smd 1.067 x 2.184: 1 -2.286,-4.572; 3 2.286,-4.572 | smd 6.096 x 9.144: 2 0,2.54
SOT23 = smd 0.8 x 0.9: 1 -0.95,-1; 2 0.95,-1; 3 0,1
M0805 = smd 1.3 x 1.6: 1 -0.95,0; 2 0.95,0
M1206 = smd 1.6 x 2: 1 -1.4,0; 2 1.4,0
RTRIM64W = drill 0.61: 1 1.27,-2.54; 2 1.27,0; 3 1.27,2.54
R2512 = smd 1.8 x 3.2: 1 -2.8,0; 2 2.8,0
9077-2 = drill 0.813 long: 1 -2.54,2.54; 2 -0.508,2.54; 3 1.524,2.54; 4 -2.54,-1.905; 5 -0.508,-1.905; 6 1.524,-1.905
TACTILE_SWITCH_SMD_5.2MM = smd 1.524 x 0.762: 1 -2.794,1.905; 2 2.794,1.905; 3 -2.794,-1.905; 4 2.794,-1.905
HTSSOP28PWP = smd 0.61 x 1.2: 1 -4.395,-3.154; 14 4.395,-3.154; 15 4.395,3.154; 28 -4.395,3.154 | smd 0.27 x 1.2: 2 -3.575,-3.154; 3 -2.925,-3.154; 4 -2.275,-3.154; 5 -1.625,-3.154; 6 -0.975,-3.154; 7 -0.325,-3.154; 8 0.325,-3.154; 9 0.975,-3.154; 10 1.625,-3.154; 11 2.275,-3.154; 12 2.925,-3.154; 13 3.575,-3.154; 16 3.575,3.154; 17 2.925,3.154; 18 2.275,3.154; 19 1.625,3.154; 20 0.975,3.154; 21 0.325,3.154; 22 -0.325,3.154; 23 -0.975,3.154; 24 -1.625,3.154; 25 -2.275,3.154; 26 -2.925,3.154; 27 -3.575,3.154 | smd 9.4 x 3: EXP 0,0
QFP80P900X900X120-32N = smd 1.473 x 0.508: 1 -4.242,2.794; 2 -4.242,2.007; 3 -4.242,1.194; 4 -4.242,0.406; 5 -4.242,-0.406; 6 -4.242,-1.194; 7 -4.242,-2.007; 8 -4.242,-2.794; 17 4.242,-2.794; 18 4.242,-2.007; 19 4.242,-1.194; 20 4.242,-0.406; 21 4.242,0.406; 22 4.242,1.194; 23 4.242,2.007; 24 4.242,2.794 | smd 0.508 x 1.473: 9 -2.794,-4.242; 10 -2.007,-4.242; 11 -1.194,-4.242; 12 -0.406,-4.242; 13 0.406,-4.242; 14 1.194,-4.242; 15 2.007,-4.242; 16 2.794,-4.242; 25 2.794,4.242; 26 2.007,4.242; 27 1.194,4.242; 28 0.406,4.242; 29 -0.406,4.242; 30 -1.194,4.242; 31 -2.007,4.242; 32 -2.794,4.242
RESONATOR-SMD-3.2X1.3 = smd 0.45 x 1.905: 1 -1.2,0; 2 0,0; 3 1.2,0

### Placement (x,y rotation side)
C1  114.43,34.42 90 top
C2  50.04,40.39 180 top
C3  95.25,55.63 0 bottom
C4  94.11,33.27 180 top
C5  102.87,43.18 0 top
C6  60.71,52.45 90 bottom
C7  100.46,46.99 180 top
C11  87.63,55.75 90 bottom
C100  106.55,16.26 270 bottom
C101  64.64,17.53 270 bottom
C102  15.62,14.48 180 bottom
C103  8.89,44.45 0 top
C104  24.26,46.74 0 bottom
D1  117.35,34.54 270 top
D100  8.89,47.62 180 top
D101  24.26,50.04 180 bottom
D102  16.64,47.75 180 top
D103  17.02,50.16 180 bottom
IC2  106.55,34.04 90 top
IC100  70.99,17.53 180 bottom
IC101  24,17.53 180 bottom
IC102  113.67,17.65 180 bottom
J1  7.49,7.37 0 top
J2  15.11,7.37 0 top
J3  22.73,7.37 0 top
J4  30.35,7.37 0 top
J5  37.97,7.37 0 top
J6  45.59,7.37 0 top
J7  53.21,7.37 0 top
J8  60.83,7.37 0 top
J9  68.45,7.37 0 top
J10  76.07,7.37 0 top
J11  83.69,7.37 0 top
J12  91.31,7.37 0 top
J13  98.93,7.37 0 top
J14  106.55,7.37 0 top
J15  114.17,7.37 0 top
J16  121.79,7.37 0 top
J18  70.99,52.7 0 top
J19  52.7,54.99 180 top
J20  15.49,54.99 180 top
J21  23.11,54.99 180 top
J22  34.16,54.99 180 top
J23  45.21,54.99 180 top
J24  118.11,54.61 270 top
J25  125.73,31.75 90 top
L1  90.17,55.75 90 bottom
LED1  79.88,40.64 0 top
LED2  2.79,31.62 0 top
Q1  7.49,18.03 180 top
Q2  15.11,18.03 180 top
Q3  22.73,18.03 180 top
Q4  30.35,18.03 180 top
Q5  37.97,18.03 180 top
Q6  45.59,18.03 180 top
Q7  53.21,18.03 180 top
Q8  60.83,18.03 180 top
Q9  68.45,18.03 180 top
Q10  76.07,18.03 180 top
Q11  83.69,18.03 180 top
Q12  91.31,18.03 180 top
Q13  98.93,18.03 180 top
Q14  106.55,18.03 180 top
Q15  114.17,18.03 180 top
Q16  121.79,18.03 180 top
Q17  110.49,48.26 270 bottom
Q18  110.49,41.91 270 bottom
Q100  42.16,47.75 180 bottom
Q101  28.7,47.88 180 bottom
R1  7.49,25.15 0 top
R2  15.11,25.15 180 top
R3  22.73,25.15 180 top
R4  30.35,25.15 180 top
R5  37.97,25.15 180 top
R6  45.59,25.15 180 top
R7  53.21,25.15 180 top
R8  60.83,25.15 180 top
R9  68.45,25.15 180 top
R10  76.07,25.15 0 top
R11  83.69,25.15 0 top
R12  91.31,25.15 0 top
R13  98.93,25.15 0 top
R14  106.55,25.15 0 top
R15  114.17,25.15 0 top
R16  121.79,25.15 0 top
R17  26.04,33.66 90 top
R18  28.19,33.66 90 top
R19  30.35,34.42 90 top
R20  32.38,34.42 90 top
R21  114.3,48.26 90 bottom
R22  110.49,52.07 180 bottom
R23  114.3,41.91 90 bottom
R24  110.36,45.09 180 bottom
R25  113.79,37.34 180 bottom
R26  119.51,37.34 180 bottom
R27  33.27,50.55 180 bottom
R28  34.54,35.43 90 top
R29  36.7,35.43 90 top
R30  105.41,48.26 0 bottom
R31  38.73,36.7 90 top
R32  40.77,36.7 90 top
R33  105.41,41.91 0 bottom
R34  62.1,38.86 180 top
R35  64.64,56.01 0 top
R36  37.97,50.55 180 bottom
R37  47.62,42.55 0 top
R38  83.82,40.39 270 top
R39  2.79,36.96 90 top
R44  97.41,37.34 180 top
R46  58.04,53.34 180 top
R100  127.89,16.64 270 top
R101  55.75,32.77 270 bottom
R102  53.21,32.77 270 bottom
R103  58.29,34.04 270 bottom
R104  63.37,34.8 270 bottom
R105  60.83,34.8 270 bottom
R106  65.91,35.31 270 bottom
R107  70.99,36.45 270 bottom
R108  68.45,36.45 270 bottom
R109  12.57,42.55 90 top
R110  20.7,44.58 90 bottom
R111  38.23,46.48 90 bottom
R112  33.66,46.48 90 bottom
R113  17.14,46.74 0 bottom
R114  16.64,44.7 0 top
R115  20.57,49.28 90 bottom
R116  12.57,49.28 90 top
R117  42.16,50.8 0 bottom
R118  28.57,50.93 0 bottom
S1  125.73,46.99 0 top
S2  65.02,49.91 180 top
U1  49.4,34.04 270 top
U2  93.98,48.26 90 bottom
Y1  90.81,40.64 0 bottom

### Tracks (layer width: path | path; a pad name or v marks a point on that pad's centre or on a via)
+3V3  (via drill 0.4)
  Top 0.406: v116.46,49.15 v116.46,45.47 v116.46,40.39
  Bottom 0.406: Q18.1 R23.2 114.3,44.45 115.32,45.47 v116.46,45.47 | Q17.1 R21.2 arc90 114.36,49.15 v116.46,49.15 | 116.46,37.34 v116.46,40.39 | R25.2 116.46,37.34 | 116.46,37.34 R26.1
+3V33  (via drill 0.4)
  Top 0.305: v28.45,52.7 35.56,52.7 | 35.56,52.7 v40.39,52.7 | v35.56,50.55 35.56,52.7
  Bottom 0.305: R27.2 v35.56,50.55 R36.1 | v40.39,52.7 41.21,51.88 R117.2 Q100.1 | v28.45,52.7 27.62,51.88 R118.2 27.75,50.8 Q101.1
+5V  (via drill 0.35, 0.4)
  Top 0.305: U1.26 54.61,36.96 54.99,37.34 v56.39,37.34 | R114.2 17.89,45 D102.C | R35.1 63.63,56.07 63.63,57.66
  Top 0.406: J19.1 52.7,57.66 | 17.91,57.66 v17.91,48.9 17.91,47.77 D102.C | v79.88,37.34 79.88,39.3 79.66,39.59 LED1.A
  Top 0.61: 45.21,57.66 34.16,57.66 | J23.1 45.21,57.66 | J22.1 34.16,57.66 | U1.28 52.56,38.73 52.56,39.88 52.56,40.14 | C2.1 52.31,40.89 | v19.3,34.54 25.97,34.54 R17.2 R18.2 28.96,35.37 R19.2 R20.2 33.4,36.38 R28.2 R29.2 36.7,37.08 37.27,37.65 R31.2 R32.2 40.77,40.39 44.83,44.45 48.26,44.45 | C7.2 99.51,54.93 99.57,54.99 96.9,57.66 92.71,57.66 | 45.21,57.66 52.7,57.66 63.63,57.66 71.12,57.66 | 71.12,57.66 92.71,57.66 | 92.71,57.66 92.58,57.53 v92.58,56.64 | J18.P$2 70.99,57.53 71.12,57.66 | 34.16,57.66 17.91,57.66 | 52.7,40.39 52.58,40.51 52.58,42.8 50.93,44.45 48.26,44.45 | 48.26,44.45 48.58,44.13 R37.2
  Top 0.813: v56.39,37.34 v57.53,37.34 57.02,37.34 57.02,38.48 55.12,40.39 53.34,40.39 52.7,40.39 | v112.78,52.07 v112.78,45.09 v112.78,38.99 120.9,38.99 125.22,43.31 S1.5 S1.2
  Top 1.016: v56.39,37.34 56.39,38.35 54.86,39.88 52.56,39.88 | v57.53,37.34 57.53,38.73 55.37,40.89 52.31,40.89 | C2.1 52.56,40.14 52.56,38.73 53.34,39.52 53.34,40.39 | v92.96,37.34 R44.2 99.72,41.05 C5.+ 99.51,43.39 C7.2
  Bottom 0.305: 112.78,37.4 arc90 R25.1 | J22.1 32.32,53.15 R27.1 32.32,48.76 R112.2 R111.2 | D103.C 15.77,48.9 | 15.77,48.9 15.77,47.16 R113.2 | v17.91,48.9 15.77,48.9
  Bottom 0.406: R24.2 v112.78,45.09
  Bottom 0.508: U2.4 94.39,42.82 93.73,42.16 | U2.6 92.79,43.1 93.73,42.16 | 93.73,42.16 93.73,37.59 93.98,37.34
  Bottom 0.61: C100.2 107.23,14.58 IC102.14 109.86,12.19 108.08,10.41 67.31,10.41 | C101.2 64.64,15.37 65.56,14.45 IC100.14 67.18,10.54 67.31,10.41 | v19.3,34.54 18.16,33.4 18.16,14.48 | 18.16,14.48 18.16,12.7 20.45,10.41 67.31,10.41 | C102.2 18.16,14.48 | IC101.14 20.17,14.48 18.16,14.48 | L1.2 92.57,56.65 v92.58,56.64
  Bottom 0.813: R102.1 R101.1 56.23,34.19 | v56.39,37.34 57.02,37.34 | 57.02,37.34 v57.53,37.34 | 57.02,34.99 57.02,35.43 57.02,37.34 | v92.96,37.34 93.98,37.34 112.71,37.34 112.78,37.4 | R25.1 112.72,37.47 112.78,37.53 v112.78,38.99 | v112.78,52.07 R22.2
  Bottom 1.016: 57.15,34.99 R103.1 59.05,35.75 | 57.15,34.99 57.02,34.99 56.39,34.35 | 59.05,35.75 R105.1 R104.1 63.88,36.26 R106.1 67.06,37.4 R108.1 R107.1 71.05,37.34 v79.88,37.34 v92.96,37.34 | 57.15,34.99 56.39,35.75 | 56.39,35.75 v56.39,37.34 | 57.34,35.75 57.53,35.94 v57.53,37.34 | 56.39,35.75 56.39,34.35 | 56.39,34.35 56.23,34.19 | 57.02,35.43 57.34,35.75 | 57.34,35.75 59.05,35.75
+12V  (via drill 0.35, 0.4)
  Top 0.305: v112.39,2.54 v114.17,2.54 113.28,2.54 v113.28,4.06 | v120.02,2.54 v121.79,2.54 121.92,2.67 | v104.78,2.54 v106.55,2.54 105.79,2.54 v105.79,3.94 | v97.16,2.54 v98.81,2.54 98.04,2.54 v98.04,3.94 | v91.44,2.54 90.42,2.54 | 90.42,2.54 v89.53,2.54 | v83.69,2.54 82.8,2.54 | 82.8,2.54 v81.92,2.54 | v75.95,2.54 75.06,2.54 | 75.06,2.54 v74.3,2.54 | v68.45,2.54 v66.67,2.54 | v51.44,2.54 v53.21,2.54 52.45,2.54 v52.45,4.06 | v43.81,2.54 v45.59,2.54 44.83,2.54 v44.83,3.94 | v12.57,2.54 v15.11,2.54 13.97,2.54 v13.97,3.81 | 126.82,7.62 J16.2 | 125.98,3.17 125.54,2.73 126.17,2.73 v127,3.56 | 126.68,3.87 126.36,3.56 126.5,3.56 | v127,9.4 127.97,7.34 v128.65,9.4 127,7.75 v127,3.56 | v127,10.92 127.33,10.13 v128.65,10.92 127.25,12.32 | v128.65,12.32 127.17,10.84 v127,10.92 | v128.65,12.32 128.65,12.57 127.89,13.34 127.89,13.2 v127.01,12.32 | v127,12.31 127,12.95 R100.2 127.01,12.95 v127.01,12.32 | 124.71,3.3 125.48,4.06 | 126.5,3.56 v127,3.56 | 121.92,2.67 124.84,2.67 124.84,3.43 | 124.84,3.43 124.84,6.91 J16.2 | 124.84,3.43 127.51,6.1 | v36.96,3.81 36.96,2.54 38.1,2.54 38.1,2.29 v36.2,2.29 | v29.46,3.94 28.57,3.94 v28.57,2.41 | v21.97,3.81 21.97,2.54 v22.73,2.54 | v60.2,3.94 60.2,2.54 v60.96,2.54 | v67.69,3.94 67.69,2.6 68.54,2.6 | v75.06,3.94 75.06,2.54 | v82.8,3.94 82.8,2.54 | v90.42,4.06 90.42,2.54 | v120.9,3.94 120.9,2.67 121.92,2.67 | v125.48,4.32 125.48,2.54 | 125.48,2.54 v125.35,2.54 | v127.89,4.95 126.5,3.56 | v127,3.56 125.98,2.54 125.48,2.54 | 127.25,12.32 v128.65,12.32 | v128.65,6.6 v128.65,7.87 128.15,7.37 J16.2 | J16.2 126.5,6.16 126.5,3.56 | 127.25,12.32 v127.01,12.32 | v127,12.31 v127.01,12.32 | v127,10.92 v127,12.31
  Top 0.406: v83.69,2.54 87.25,2.54 87.5,2.79 | v75.95,2.54 79.12,2.41 79.5,2.79 | v91.44,2.54 94.87,2.54 95.12,2.79 | v98.81,2.54 99.06,2.79 102.74,2.79 | v106.55,2.54 106.81,2.79 110.36,2.79 | v114.17,2.54 114.43,2.79 117.98,2.79 | v68.45,2.54 68.54,2.6 68.83,2.79 71.88,2.79 | v60.96,2.54 61.21,2.79 64.26,2.79 | v45.59,2.54 45.85,2.79 48.9,2.79 | v53.21,2.54 53.47,2.79 56.52,2.79 | v37.97,2.54 38.1,2.54 41.27,2.54 41.53,2.79 | v30.35,2.54 33.4,2.54 33.66,2.79 | v22.73,2.54 25.78,2.54 26.04,2.79 | v12.57,2.54 12.32,2.79 | 10.99,4.12 6.8,4.12 2.79,8.13 LED2.A
  Top 2.54: 125.86,2.67 124.84,2.67 | 125.29,3.48 J16.2 | 117.98,2.79 117.67,3.1 J15.2 | 110.36,2.79 110.05,3.1 J14.2 | 102.74,2.79 102.43,3.1 J13.2 | 95.12,2.79 94.81,3.1 J12.2 | J11.2 87.19,3.1 87.5,2.79 | J10.2 79.57,2.87 79.5,2.79 | J9.2 71.95,2.87 71.88,2.79 | J8.2 64.33,2.87 64.26,2.79 | J7.2 56.71,2.99 56.52,2.79 | J6.2 49.09,2.99 48.9,2.79 | J5.2 41.47,2.85 41.53,2.79 | J4.2 33.85,2.99 33.66,2.79 | J3.2 26.23,2.99 26.04,2.79 | J2.2 18.61,2.85 | J1.2 10.99,4.12 12.32,2.79
  Top 3.175: 125.48,4.06 127.51,6.1 | 127.51,6.1 127.89,6.48 | 127.51,6.1 127.51,4.7 126.36,3.56 125.98,3.17
  Top 3.81: 10.99,4.12 11.81,3.3 124.71,3.3 | 127.89,13.34 127.89,6.48
  Bottom 0.305: v120.02,2.54 118.11,2.54 117.78,2.87 117.67,2.87 | 125.73,3.56 124.97,3.56 | v112.39,2.54 v106.55,2.54 | v104.78,2.54 v98.81,2.54 | v97.16,2.54 v91.44,2.54 | v89.53,2.54 v83.69,2.54 | v81.92,2.54 v75.95,2.54 | v74.3,2.54 v68.45,2.54 | v66.67,2.54 v60.96,2.54 v59.05,2.54 v53.21,2.54 v45.59,2.54 | v37.97,2.54 v43.81,2.54 | v30.35,2.54 28.7,2.54 v28.57,2.41 22.86,2.41 v22.73,2.54 v20.95,2.54 | v20.95,2.54 v15.11,2.54 | v20.95,2.54 18.61,4.88 J2.2 | 125.73,2.92 125.73,3.56 | 126.24,3.43 126.49,3.43 126.87,3.43 v127,3.56 | v128.65,9.4 126.87,7.62 | 127.89,7.62 127.13,7.62 | v128.65,10.92 128.65,7.24 127.25,5.84 | 127.25,5.84 127.13,5.71 | 127.13,6.86 127.13,7.62 | 127.13,5.71 127.13,6.86 | 127.13,6.86 127.89,7.62 | 126.87,7.62 125.55,7.62 J16.2 125.29,3.88 125.29,3.81 | 126.87,7.62 127.13,7.62 | 127.89,7.62 128.02,7.62 | 125.29,3.81 125.29,2.72 | 125.29,2.72 125.35,2.67 | 125.48,3.3 126.75,3.3 v127,3.56 | 125.35,2.67 125.35,3.17 125.22,3.3 | 125.22,3.3 124.97,3.56 | 124.71,3.3 125.22,3.3 | 124.71,3.3 123.95,2.54 v121.79,2.54 | 124.97,3.56 125.22,3.81 | 125.22,3.81 125.29,3.81 | 124.71,3.3 124.97,3.56 | 125.73,3.56 v127,3.56 | 124.71,3.3 125.29,2.72 | 126.87,5.46 127.13,5.71 | 125.22,3.81 126.87,5.46 | 126.87,5.46 127.64,5.46 127.25,5.84 | 125.22,3.3 125.48,3.3 | 125.48,3.3 125.73,3.56 | v127,12.31 127.13,12.44 128.53,12.44 | v127,3.56 126.11,2.67 125.35,2.67 | v125.48,4.32 126.24,3.56 v127,3.56
  Bottom 2.54: 125.22,6.17 J16.2 | 10.99,4.25 J1.2 | 126.49,3.43 125.73,2.67 | J2.2 18.61,2.87 | J3.2 26.23,2.85 | J4.2 33.85,2.85 | J5.2 41.47,2.85 | J6.2 49.09,2.87 | J7.2 56.71,2.98 | J8.2 64.33,2.87 | J9.2 71.95,2.98 | J10.2 79.57,2.85 | J11.2 87.19,2.99 | J12.2 94.81,2.85 | J13.2 102.43,2.87 | J14.2 110.05,2.87 | J15.2 117.67,2.87
  Bottom 3.81: 10.99,4.25 11.94,3.3 124.71,3.3 | 124.97,3.56 125.29,3.88 127.13,5.71 | 128.02,7.62 128.02,13.34
BLANK  (via drill 0.35)
  Top 0.305: U1.2 45.45,37.61 44.58,38.48 44.58,42.04 v45.09,42.55 R37.1
  Bottom 0.305: U2.14 80.95,49.45 74.04,42.55 v45.09,42.55
GND  (via drill 0.35, 0.4, 0.5)
  Top 0.305: 48.09,34.63 v48.51,34.8 | U1.6 48.3,35.01 v48.51,34.8 | U1.EXP v49.4,35.69 | 49.4,31.37 48.39,30.35 48.39,31.37 v48.51,31.5 | 49.4,31.37 49.4,30.35 48.26,29.21 | 49.28,34.04 v48.51,33.27 | 49.28,35.31 v50.29,36.58 | U1.EXP 49.28,35.31 | 49.28,35.31 v48.51,36.58 | U1.EXP 49.28,34.04 | 49.28,34.04 v48.51,34.8 | U1.EXP 49.4,31.37 | U1.EXP v49.4,32.38 v50.29,31.5 | 27.94,22.35 27.43,22.86 27.43,23.75 28.07,23.75 | D100.A 7.64,44.7 C103.1
  Top 0.406: 28.07,23.88 v27.94,26.92 | U1.1 46.5,38.43 46.52,38.42 46.86,38.76 | 46.86,38.76 46.86,38.86 45.72,38.86 46.15,38.43 U1.1 | U1.EXP 49.4,37.97 49.4,38.86 | 49.4,38.86 50.8,38.86 | 49.4,38.86 48.39,38.86 48.01,38.48 47.72,38.76 46.86,38.76 | U1.1 48.69,38.43 48.77,38.35 48.64,38.23 v50.29,36.58 | J20.2 7.64,50.64 D100.A
  Top 0.61: Q16.3 119.51,25.08 R16.1 | 111.89,25.08 R15.1 113.22,28.96 | Q12.3 89.03,25.08 R12.1 90.36,29.27 90.3,29.34 | R16.1 120.84,27.75 | 105.54,29.34 97.79,29.34 | 97.79,29.34 90.3,29.34 | 90.3,29.34 82.8,29.34 | 82.8,29.34 75.95,29.34 75.06,28.45 75.12,28.38 R10.1 | 105.54,29.34 113.28,29.34 113.22,29.28 113.22,28.96 | R16.1 120.9,26.48 120.9,29.34 | 105.54,29.34 105.6,29.27 R14.1 104.27,25.08 104.27,22.48 103.63,21.84 | 97.79,29.34 97.98,29.14 R13.1 96.65,25.08 96.65,22.73 95.89,21.97 95.89,23.88 97.28,23.88 97.28,21.84 95.89,21.84 Q13.3 | 82.8,29.34 82.74,29.28 R11.1 81.41,25.08 81.41,22.73 80.64,21.97 80.64,24 81.92,24 82.17,23.75 82.17,21.84 80.64,21.84 Q11.3 | 5.21,22.86 Q1.3 4.57,21.97 | 5.21,22.86 5.21,25.08 R1.1 | R3.2 20.45,25.08 20.45,22.73 19.68,21.97 19.68,23.88 21.08,23.88 21.21,23.75 21.21,21.97 21.08,21.84 19.68,21.84 Q3.3 | 28.07,23.88 28.07,23.75 28.07,22.35 27.94,22.35 | 28.07,23.88 28.07,25.08 R4.2 29.4,28.13 29.34,28.19 | 43.31,23.11 43.31,25.08 R6.2 44.64,28.01 | 49.4,28.19 48.13,28.19 arc90 48.26,28.32 48.26,29.21 48.26,29.59 arc90 48.39,29.72 48.39,30.35 arc90 49.4,31.37 v49.4,32.38 | 67.5,28 R9.2 66.17,25.08 66.17,23.24 65.91,23.24 65.66,23.5 65.53,23.37 65.53,22.1 65.41,21.97 65.28,22.1 65.28,23.88 66.93,23.88 66.93,21.97 67.06,21.84 65.41,21.84 Q9.3 | 59.82,28.19 59.88,28.13 R8.2 58.55,25.08 58.55,23.11 58.04,23.62 57.91,23.62 57.91,22.1 57.78,21.97 57.66,22.1 57.66,24 59.18,24 59.31,23.88 59.31,21.84 57.78,21.84 Q8.3 | 52.26,28.13 R7.2 50.93,25.08 50.93,22.48 50.16,21.72 | 37.08,28.19 37.02,28.13 R5.2 35.69,25.08 Q5.3 34.92,21.84
  Top 0.61: v14.35,28.96 12.76,25.15 12.83,25.08 Q2.3 12.06,21.84 | 49.4,28.19 arc-90 48.77,28.83 | 48.77,28.83 48.77,29.59 49.4,30.23 49.4,29.46 arc-90 48.77,28.83 | 48.77,28.83 arc90 49.4,28.19 | 49.4,28.19 49.66,28.19 | 49.66,28.19 50.16,28.19 50.16,28.7 | 50.16,28.7 50.16,33.27 arc90 U1.EXP arc-90 49.66,33.78 49.66,28.19 | 48.77,28.83 arc-90 49.4,28.19 | 50.67,28.19 50.67,29.21 arc90 50.16,28.7 | 113.22,28.96 113.6,29.34 120.9,29.34 | 120.9,29.34 121.28,29.34 | 4.57,21.97 4.57,21.84 5.71,21.84 5.84,21.97 5.84,23.88 4.45,23.88 | 12.06,21.84 13.46,21.84 13.46,23.75 11.94,23.75 12.06,23.62 12.06,21.84 | 4.57,21.97 4.57,23.37 5.08,22.86 5.21,22.86 | Q4.3 28.07,22.48 27.94,22.35 | 27.94,22.35 27.3,21.72 28.83,21.72 28.83,23.88 28.07,23.88 | 27.69,22.35 27.94,22.35 | 34.92,21.84 34.92,21.72 36.45,21.72 36.45,23.88 34.92,23.88 34.92,21.84 | Q6.3 42.55,21.84 42.55,21.72 43.94,21.72 43.94,23.88 42.42,23.88 42.42,22.23 | 42.42,21.72 42.42,22.23 | 42.42,22.23 42.8,22.61 42.8,23.62 43.31,23.11 | 43.31,23.11 43.31,22.99 | Q7.3 50.16,21.84 | 50.16,21.84 50.16,21.72 | 50.16,21.72 51.69,21.72 51.69,23.75 51.56,23.88 50.16,23.88 50.16,21.84 | Q10.3 73.03,21.84 74.42,21.84 74.55,21.97 74.42,22.1 74.42,23.75 74.3,23.88 73.15,23.88 73.15,22.1 73.79,22.73 | Q12.3 88.27,21.84 89.79,21.84 89.79,23.88 88.14,23.88 88.14,21.97 88.77,22.61 Q12.3 | Q14.3 103.5,21.84 103.63,21.84 | 103.63,21.84 105.03,21.84 105.03,23.88 104.9,24 103.5,24 103.5,21.97 103.63,21.84 | Q15.3 111.12,21.84 | 111.12,21.84 111.12,21.72 112.65,21.72 112.78,21.84 112.65,21.97 112.65,23.88 111.12,23.88 111.12,21.84 | Q16.3 118.75,21.84 118.75,21.72 120.27,21.72 120.27,23.88 120.14,24 118.75,24 118.75,21.97 118.87,21.97 Q16.3
  Top 0.813: Q13.3 96.65,22.48 | Q14.3 104.27,21.21 | 35.69,21.84 Q5.3 | 28.07,22.48 28.07,22.35 | J24.3 120.65,49.53 120.65,48.26
  Top 1.016: 48.01,40.39 C2.2 | 48.39,38.86 48.39,39.73 C2.2 | C2.2 49.04,38.34 49.4,37.97 | 70.61,28.19 50.67,28.19 | 48.13,28.19 29.34,28.19
  Top 2.54: J25.2 123.27,36.75 123.19,36.83 125.73,36.83 | 127,38.1 125.73,36.83 | J25.2 125.73,35.56 127,35.56 128.27,36.83 | J25.2 125.73,36.83 | 125.73,36.83 124.46,38.1
  Bottom 0.305: 48.51,30.73 50.29,30.73 | 49.4,30.23 v49.4,32.38 U1.EXP v49.4,35.69 49.4,37.47 | v48.51,31.5 v50.29,31.5 | v48.51,34.8 v50.29,34.8 | 48.39,37.97 50.42,37.97 | J22.3 27.16,54.59 | Y1.2 90.81,39.12 90.68,38.99 88.01,38.99 v87.38,39.62 | v48.51,36.58 v50.29,36.58
  Bottom 0.406: IC101.7 27.81,24.26 v27.94,26.92 | C101.1 64.64,20.7 | C100.1 111.12,17.26 | 111.12,17.26 113.54,17.26 | 113.54,17.26 115.43,17.26 117.47,19.3 IC102.7 | IC102.13 111.12,17.26 | IC102.11 113.67,17.13 113.54,17.26 | J22.3 25.51,53.34 D101.A 25.51,46.99 C104.1 | J23.3 38.21,52.85 38.92,52.14 R36.2 | 49.45,57.66 54.99,57.66 R46.1 | U2.21 94.39,47.52 | U2.5 93.57,46.71 v94.36,47.5 94.39,47.52 | 94.39,47.52 95.17,46.74 U2.3
  Bottom 0.61: 11.81,28.19 13.59,28.19 13.59,31.11 20.32,37.85 29.72,37.85 | 11.81,28.19 9.91,28.19 | 11.81,28.19 v14.35,28.96 11.81,16.38 13.72,14.48 C102.1 | 27.18,57.66 37.97,57.66 38.23,57.66 38.21,57.64 J23.3 | 27.18,57.66 19.43,57.66 | 19.43,57.66 13.59,57.66 11.99,56.06 J20.2 | J21.2 19.61,57.48 19.43,57.66 | J22.3 27.16,57.64 27.18,57.66 | IC100.7 74.8,23.88 v73.66,25.02 71.25,27.43 v65.15,27.18
  Bottom 0.813: 37.97,57.66 49.45,57.66
  Bottom 2.54: J25.2 125.65,36.83 | 125.65,36.83 123.19,36.83 | 125.65,36.83 128.27,36.83 127,38.1 | 127,38.1 125.73,38.1 | J25.2 125.73,35.56 127,35.56 127,38.1 | J25.2 124.46,38.02 124.46,38.1
  other vias: 13.08,27.69 49.4,34.04 52.96,22.1 14.86,23.24 14.86,22.1 7.11,23.11 7.11,21.97 13.08,28.96 14.35,27.69 105.79,22.1 121.79,23.37 98.17,22.1 37.59,23.11 37.59,21.97 45.09,23.24 45.09,22.1 52.96,23.24 98.17,23.37 105.79,23.37 121.79,22.35 50.29,33.27 27.94,28.07 94.36,48.9 94.36,50.16 87.38,41.15 77.6,39.12 94.36,33.53 104.52,55.12 107.06,55.12 97.79,54.36 85.6,55.5 67.69,50.04 61.34,50.04 120.65,45.85 120.65,44.58 85.34,34.29 85.34,31.75 103.25,39.88 105.79,39.88 46.1,50.04 51.18,50.04 25.78,39.88 27.05,39.88 8,37.34 6.73,37.34 40.77,27.56 42.04,26.29 36.96,27.81
  pour Top (isolate 0.711): 0,62.23 131.06,62.23 131.06,2.54 0,2.54
  pour Bottom (isolate 0.711): 0,62.23 131.06,62.23 131.06,13.97 0,13.97
GSCLK  (via drill 0.4)
  Top 0.305: v95.76,41.91 90.16,36.31 U1.25
  Bottom 0.305: U2.1 96.77,42.93 v95.76,41.91
LIGHT_SENSOR  (via drill 0.4)
  Top 0.305: v95.5,53.98 v80.64,53.98
  Bottom 0.305: J19.2 50.86,53.34 R46.2 56.83,53.4 C6.2 61.28,53.98 v80.64,53.98 | U2.23 95.99,53.49 v95.5,53.98
MISO  (via drill 0.4)
  Top 0.305: v83.69,51.05 72.14,51.05 70.99,52.2 J18.P$1
  Bottom 0.305: U2.16 v83.69,51.05
MOSI_SIN  (via drill 0.4)
  Top 0.305: v42.42,36.96 42.42,36.2 42.95,35.66 U1.5 | v83.82,47.88 v86.23,50.29 83.95,52.58 80.64,52.58 76.45,56.77 75.06,56.77 J18.P$4
  Bottom 0.305: U2.15 86.26,50.27 v86.23,50.29 | v42.42,36.96 45.21,39.75 75.69,39.75 v83.82,47.88
N$1  (via drill 0.4)
  Top 0.305: R32.1 40.77,35.05 v41.27,34.54 41.46,34.36 U1.7
  Bottom 0.305: IC101.1 20.19,32.64 23.5,35.94 39.88,35.94 v41.27,34.54
N$2  (via drill 0.4)
  Top 0.305: U1.8 39.7,33.71 v38.99,34.42 38.73,34.67 R31.1
  Bottom 0.305: IC101.3 22.73,31.62 26.16,35.05 38.35,35.05 v38.99,34.42
N$3  (via drill 0.4)
  Top 0.305: U1.9 36.92,33.06 v36.7,33.27 R29.1
  Bottom 0.305: IC101.5 25.27,29.21 30.23,34.16 35.81,34.16 v36.7,33.27
N$4  (via drill 0.4)
  Top 0.305: U1.10 35.28,32.41 v34.54,33.15 R28.1
  Bottom 0.305: IC101.9 26.54,12.95 26.8,12.7 28.7,12.7 34.54,18.54 v34.54,33.15
N$5  (via drill 0.4)
  Top 0.305: U1.11 32.76,31.76 v32.38,32.13 R20.1
  Bottom 0.305: IC101.11 24,15.75 24.64,16.38 28.19,16.38 31.37,19.56 31.37,25.78 32.38,26.8 v32.38,32.13
N$6  (via drill 0.4)
  Top 0.305: U1.12 30.86,31.11 30.35,31.62 v30.35,32.13 R19.1
  Bottom 0.305: IC101.13 21.46,16.26 22.73,17.53 27.81,17.53 30.35,20.07 v30.35,32.13
N$7  (via drill 0.4)
  Top 0.305: U1.13 42.02,30.46 v41.91,30.35 29.84,30.35 28.19,32 R18.1
  Bottom 0.305: IC100.1 67.18,21.84 66.93,22.1 56.26,22.1 51.31,27.05 44.07,27.05 41.91,29.21 v41.91,30.35
N$8  (via drill 0.4)
  Top 0.305: U1.14 43.64,29.64 v43.56,29.72 43.43,29.59 29.08,29.59 27.18,31.5 26.42,31.5 26.04,31.88 R17.1
  Bottom 0.305: IC100.3 69.72,22.23 68.33,23.62 58.42,23.62 54.1,27.94 44.7,27.94 43.56,29.08 v43.56,29.72
N$9  (via drill 0.4)
  Top 0.305: v72.9,35.18 61.98,35.18 61.16,34.36 U1.22
  Bottom 0.305: IC102.9 116.2,16.26 119,19.05 119,25.4 115.19,29.21 78.87,29.21 v72.9,35.18 71.44,35.18 R107.2
N$10  (via drill 0.4)
  Top 0.305: Q1.1 9.91,22.73 9.91,24.64 9.4,25.15 R1.2 8.44,26.86 14.48,32.89 20.95,32.89 v21.46,32.38
  Bottom 0.305: IC101.2 v21.46,32.38
N$11  (via drill 0.4)
  Top 0.305: U1.20 65.87,33.06 v65.91,33.02
  Bottom 0.305: IC102.3 112.39,22.48 107.5,27.37 77.53,27.37 71.88,33.02 v65.91,33.02 R106.2
N$12  (via drill 0.4)
  Top 0.305: U1.19 63.22,32.41 v63.88,31.75
  Bottom 0.305: IC102.1 109.86,22.35 106.81,25.4 80.9,25.4 79.88,26.42 77.22,26.42 71.88,31.75 v63.88,31.75 63.37,32.26 R104.2
N$13  (via drill 0.4)
  Top 0.305: v57.15,31.11 56.5,31.76 U1.18
  Bottom 0.305: IC100.13 68.45,16.26 70.36,18.16 75.31,18.16 75.95,18.8 75.95,24.13 71.37,28.7 59.56,28.7 v57.15,31.11 56.45,31.82 R101.2
N$14  (via drill 0.4)
  Top 0.305: U1.17 54.61,31.11 55.56,30.16 57.59,30.16 v58.93,31.5
  Bottom 0.305: IC100.11 70.99,16 71.37,16.38 76.58,16.38 77.34,17.14 77.34,24 71.75,29.59 60.83,29.59 v58.93,31.5 58.29,32.13 R103.2
N$15  (via drill 0.4)
  Top 0.305: U1.16 54.12,30.46 55.12,29.46 58.8,29.46 v60.83,31.5
  Bottom 0.305: IC100.9 73.53,13.08 73.91,12.7 75.95,12.7 80.26,17.02 80.26,24.51 78.99,25.78 76.71,25.78 72.01,30.48 61.85,30.48 v60.83,31.5 R105.2
N$16  (via drill 0.4)
  Top 0.305: U1.15 53.67,29.64 v53.72,29.59
  Bottom 0.305: IC100.5 72.26,23.5 70.1,25.65 57.53,25.65 53.72,29.46 v53.72,29.59 53.21,30.1 R102.2
N$17  (via drill 0.4)
  Top 0.305: U1.21 61.65,33.71 62.1,34.16 v68.45,34.16
  Bottom 0.305: IC102.5 114.94,23.88 110.49,28.32 78.36,28.19 72.39,34.16 v68.45,34.16 R108.2
N$18
  Top 2.54: Q2.2 J2.1
N$19  (via drill 0.4)
  Top 0.305: Q3.1 25.02,24.13 25.02,24.77 25.02,25.15 | v26.54,24.38 25.78,25.15 25.02,25.15 | 25.02,25.15 R3.1
  Bottom 0.305: IC101.6 v26.54,24.38
N$20
  Top 2.54: Q4.2 J4.1
N$21  (via drill 0.4)
  Top 0.305: Q8.1 63.12,24.77 63.25,24.64 v63.12,24.64 63.12,25.27 62.87,25.53 62.16,25.53 R8.1
  Bottom 0.305: IC100.4 70.99,23.37 69.72,24.64 v63.12,24.64
N$22
  Top 2.54: Q3.2 J3.1
N$23  (via drill 0.4)
  Top 0.305: Q4.1 v32.64,24.77 32.64,25.02 32.38,25.27 31.43,25.27 R4.1
  Bottom 0.305: IC101.8 32.64,19.28 v32.64,24.77
N$24  (via drill 0.4)
  Top 0.305: Q16.1 v124.08,24.64 124.08,24.89 123.83,25.15 R16.2
  Bottom 0.305: IC102.8 124.08,21.18 v124.08,24.64
N$25
  Top 2.54: Q16.2 J16.1
N$26
  Top 2.54: Q1.2 J1.1
N$27  (via drill 0.4)
  Top 0.305: v40.26,24.77 40.26,25.15 40.01,25.4 39.18,25.4 R5.1
  Top 0.406: Q5.1 v40.26,24.77
  Bottom 0.305: v40.26,24.77 40.26,19.94 32.38,12.06 26.16,12.06 25.27,12.95 IC101.10
N$28
  Top 2.54: Q5.2 J5.1
N$29
  Top 2.54: Q8.2 J8.1
N$30  (via drill 0.4)
  Top 0.305: Q6.1 v47.88,24.77 47.88,25.4 47.62,25.65 46.67,25.65 46.54,25.53 | 46.54,25.71 46.54,25.53 | 46.54,25.53 R6.1
  Bottom 0.305: IC101.12 22.73,13.21 24.51,11.43 38.48,11.43 47.88,20.83 v47.88,24.77
N$31
  Top 2.54: Q10.2 J10.1
N$32
  Top 2.54: Q6.2 J6.1
N$33  (via drill 0.4)
  Top 0.305: R15.2 115.95,25.15 v116.46,24.64 Q15.1
  Bottom 0.305: IC102.6 116.2,24.38 v116.46,24.64
N$34
  Top 2.54: Q15.2 J15.1
N$35
  Top 0.813: J24.2 120.65,52.07 S1.1 S1.4
N$36  (via drill 0.4)
  Top 0.305: v110.36,26.42 108.08,26.42 107.5,25.84 R14.2 108.46,25.15 108.84,24.77 Q14.1
  Bottom 0.305: v110.36,26.42 113.67,23.11 IC102.4
N$37
  Top 2.54: Q14.2 J14.1
N$38  (via drill 0.4)
  Top 0.305: Q10.1 v78.36,24.77 77.98,25.15 R10.2
  Bottom 0.305: v78.36,24.77 78.36,16.89 75.69,14.22 75.03,14.22 IC100.8
N$39  (via drill 0.4)
  Top 0.305: Q13.1 101.22,24.51 100.58,25.15 R13.2 99.88,25.97 100.33,26.42 v101.22,26.42
  Bottom 0.305: IC102.2 111.12,22.35 107.06,26.42 v101.22,26.42
N$40  (via drill 0.4)
  Top 0.305: v70.74,26.42 69.72,26.42 69.4,26.1 69.4,25.21 | 69.4,25.21 R9.1 | Q9.1 70.74,24.77 70.36,25.15 69.47,25.15 69.4,25.21
  Bottom 0.305: IC100.6 73.53,23.75 70.87,26.42 v70.74,26.42
N$41
  Top 2.54: Q13.2 J13.1
N$42
  Top 0.305: J20.1 12.57,52.07 R116.2
N$43  (via drill 0.4)
  Top 0.305: Q12.1 v93.6,24.51 93.6,25.15 93.34,25.4 92.52,25.4 R12.2
  Bottom 0.305: v93.6,24.51 93.6,21.59 83.44,11.43 71.12,11.43 69.72,12.83 IC100.12
N$44
  Top 2.54: Q12.2 J12.1
N$45
  Top 2.54: Q9.2 J9.1
N$46  (via drill 0.4)
  Top 0.305: Q11.1 v85.98,24.51 85.98,25.02 85.72,25.27 84.77,25.27 R11.2
  Bottom 0.305: v85.98,24.51 85.98,20.07 77.98,12.06 72.77,12.06 72.26,12.57 IC100.10
N$47
  Top 2.54: Q11.2 J11.1
N$48
  Bottom 0.305: J21.1 20.57,52.45 R115.2
N$49
  Bottom 0.406: U2.30 103.27,47.07 R30.2
N$50
  Bottom 0.406: U2.31 102.21,46.25 104.46,44 R33.2
N$51
  Top 0.152: 115.33,36.32 C1.2 | 115.33,36.32 | 115.33,36.32 117.35,36.32
  Top 0.305: D1.C 117.35,36.32
  Top 2.54: IC2.3 113.03,36.32 115.33,36.32 | 117.35,36.32 115.44,36.32
N$52  (via drill 0.35, 0.4)
  Top 0.305: v128.14,29.46 127.8,28.18 127.51,27.12 | 127.51,27.12 127.25,26.16 | 127.51,27.12 v126.62,29.21 | v126.62,29.21 127.13,28.7 v127.13,26.8 | v126.62,29.21 127.25,28.58 127.78,24.44 v128.65,21.08 | v128.65,21.08 126.57,25.25 126.87,22.86 128.16,23.99 v127.13,25.02 127.86,23.34 v128.65,22.99 128.65,25.37 127.3,26.72 127.25,26.97 127.24,27.04 127.25,27.05 | v128.65,21.08 128.4,21.12 127.4,22.29 127.05,20.31 127,21.02 126.87,20.95 | 128.54,23.75 v128.65,21.08 | R100.1 127.89,20.71 126.75,21.85 126.75,25.02 v128.65,25.02
  Top 0.406: 126.87,20.95 128.31,20.95 v128.65,21.08 128.4,21.08 127.87,20.55 127.87,19.94 | v127.13,22.99 126.75,22.07 126.94,21.11 v127,21.08 126.96,21.42 127.94,24.2 v127.13,25.02
  Top 1.27: 118.35,31.5 D1.A
  Top 2.54: J25.1 118.09,31.75 D1.A
  Top 3.175: 127.23,29.86 127.25,29.84 127.25,27.05 127.25,26.16
  Top 3.81: 127.87,19.94 127.87,29.23 127.23,29.86 127,30.1 127,30.48 J25.1 126.24,31.75 127.89,30.1 127.8,30.01 127.8,28.18
  Bottom 0.305: v128.65,25.02 v128.65,22.99 | v127.13,26.8 127.51,26.8 v128.65,26.8
  Bottom 3.81: 127.51,26.8 127.51,23.11 127.76,22.86 127.76,29.97 127.51,30.23 127.64,30.35 126.24,31.75 J25.1 127.25,30.23 127.25,29.08 | 127.25,28.57 127.25,29.08 | 127.25,29.08 128.14,29.97 | 128.14,29.97 128.14,30.1 | 128.14,29.97 128.14,20.45 127.64,19.94 127.64,21.59 127.89,21.84 128.14,21.59 128.14,19.94
N$53
  Bottom 0.305: U2.7 91.97,40.67 Y1.1
N$54
  Bottom 0.305: U2.8 89.61,42.44 Y1.3
N$55  (via drill 0.35, 0.4)
  Top 0.305: U1.27 53.36,37.61 v54.23,38.48 | v58.8,38.86 R34.2
  Bottom 0.305: v54.23,38.48 54.61,38.86 v58.8,38.86
N$56
  Top 0.406: R38.1 83.47,41.69 LED1.C
N$57
  Bottom 0.305: 20.7,48.26 R110.2 | D101.C 21.23,48.26 20.7,48.26 | 20.7,48.26 20.57,48.26 R115.1 20.11,48.33 D103.A
N$58
  Top 0.406: R39.1 LED2.C
N$59
  Top 0.305: D102.A 13.15,47.75 R116.1 | D100.C 11.87,47.62 R116.1 | R116.1 R109.2
N$63
  Bottom 0.305: J22.2 30.66,52.06 R118.1 29.65,50.8 Q101.2
N$64
  Bottom 0.305: Q100.2 R117.1 43.11,52.52 41.71,53.92 J23.2
N$65
  Bottom 0.406: C11.1 90.12,54.8 L1.1 91.58,54.85 91.97,54.46 91.97,53.05 91.97,52.83 U2.18
N$66
  Top 1.016: R44.1 98.81,33.52 99.06,33.27
  Top 2.54: IC2.4 103.41,33.27 99.06,33.27 C4.+
N$67
  Bottom 0.406: C3.2 93.57,54.9 U2.20
N$70  (via drill 0.4)
  Top 0.305: Q2.1 17.4,24.64 16.89,25.15 R2.1 16.06,26.73 18.54,29.21 23.62,29.21 v24,28.83
  Bottom 0.305: IC101.4 v24,28.83
N$71  (via drill 0.4)
  Top 0.305: Q7.1 v55.5,24.89 55.5,25.4 55.24,25.65 54.1,25.65 54.16,25.59 R7.1
  Bottom 0.305: IC100.2 68.45,22.1 67.69,22.86 57.53,22.86 v55.5,24.89
N$73
  Top 2.54: Q7.2 J7.1
RESET
  Top 0.305: R35.2 67.31,56.01 67.82,55.5 67.82,53.98 | 67.82,53.98 S2.3 | J18.P$5 74.8,53.98 67.82,53.98
  Bottom 0.305: U2.29 100.05,47.85 101.09,48.9 101.09,54.48 97.92,57.66 85.6,57.66 80.64,52.7 J18.P$5
RXD
  Bottom 0.406: R30.1 Q17.3 109.49,52.02 R22.1
RXD_BL
  Bottom 0.406: J24.4 114.62,46.99 R21.1 Q17.2
SCLK  (via drill 0.35)
  Top 0.305: U1.4 44.46,36.31 42.67,38.1 v42.67,38.86
  Bottom 0.305: U2.17 82.6,52.5 78.17,48.07 | 78.17,48.07 73.41,43.31 44.2,43.31 42.67,41.78 v42.67,38.86 | J18.P$3 78.17,48.07
SENSOR_BOTTOM  (via drill 0.4)
  Top 0.305: v85.34,47.62 84.58,46.86 83.82,46.86 83.44,46.86 v75.18,46.86
  Bottom 0.305: R111.1 40.94,45.53 Q100.3 42.27,46.86 58.42,46.86 59.69,46.86 v75.18,46.86 | U2.12 85.57,47.85 v85.34,47.62
SENSOR_TOP  (via drill 0.4)
  Top 0.305: v86.11,46.61 85.47,45.97 v74.17,45.97
  Bottom 0.305: Q101.3 28.7,46.35 29.52,45.53 R112.1 34.86,44.32 41.53,44.32 43.18,45.97 v74.17,45.97 | U2.11 86.56,47.07 v86.11,46.61
SWITCH_BOTTOM  (via drill 0.4)
  Top 0.305: v87,45.47 86.49,44.96 v73.28,44.96
  Bottom 0.305: 23.37,43.63 42.23,43.63 43.56,44.96 v73.28,44.96 | 23.37,43.63 R110.1 19.75,43.63 18.09,45.28 R113.1 | U2.10 87.78,46.25 v87,45.47 | C104.2 23.26,43.74 23.37,43.63
SWITCH_TOP  (via drill 0.4)
  Top 0.305: R114.1 15.75,44.64 15.75,42.8 v15.24,42.29 14.54,41.59 R109.1 10.86,41.59 9.89,42.56 C103.2 | v88.01,44.07 v72.26,44.07
  Bottom 0.305: U2.9 88.34,44.07 v88.01,44.07 | v15.24,42.29 41.91,42.29 43.69,44.07 v72.26,44.07
TXD
  Bottom 0.406: R33.1 Q18.3 109.41,41.99 R24.1
TXD_BL
  Bottom 0.406: Q18.2 R23.1 115.51,40.96 115.95,41.4 115.95,43.18 117.22,44.45 J24.5
XLAT  (via drill 0.4)
  Top 0.305: U1.3 45.08,36.96 43.56,38.48 v43.56,41.27
  Bottom 0.305: v43.56,41.27 44.07,41.78 74.42,41.78 81.31,48.67 U2.13

### Text on the board
tNames: BLUETOOTH | TOP / SWITCH | 5V | MOSI | GND / MISO | SCLK | RST | BOTTOM / SWITCH | TOP SENSOR / GND | IN | +5V | BOTTOM SENSOR / GND | IN | +5V | LIGHT / SENSOR | RESET | TX | RX | GND | 5V | GND | 5V LED | 12V LED | 12V | - 1 + | - 2 + | - 3 + | - 4 + | - 5 + | - 6 + | - 7 + | - 8 + | - 9 + | - 10 + | - 11 + | - 12 + | - 13 + | - 14 + | - 15 + | - 16 +